# Altium project CBU-PCB.PrjPcb
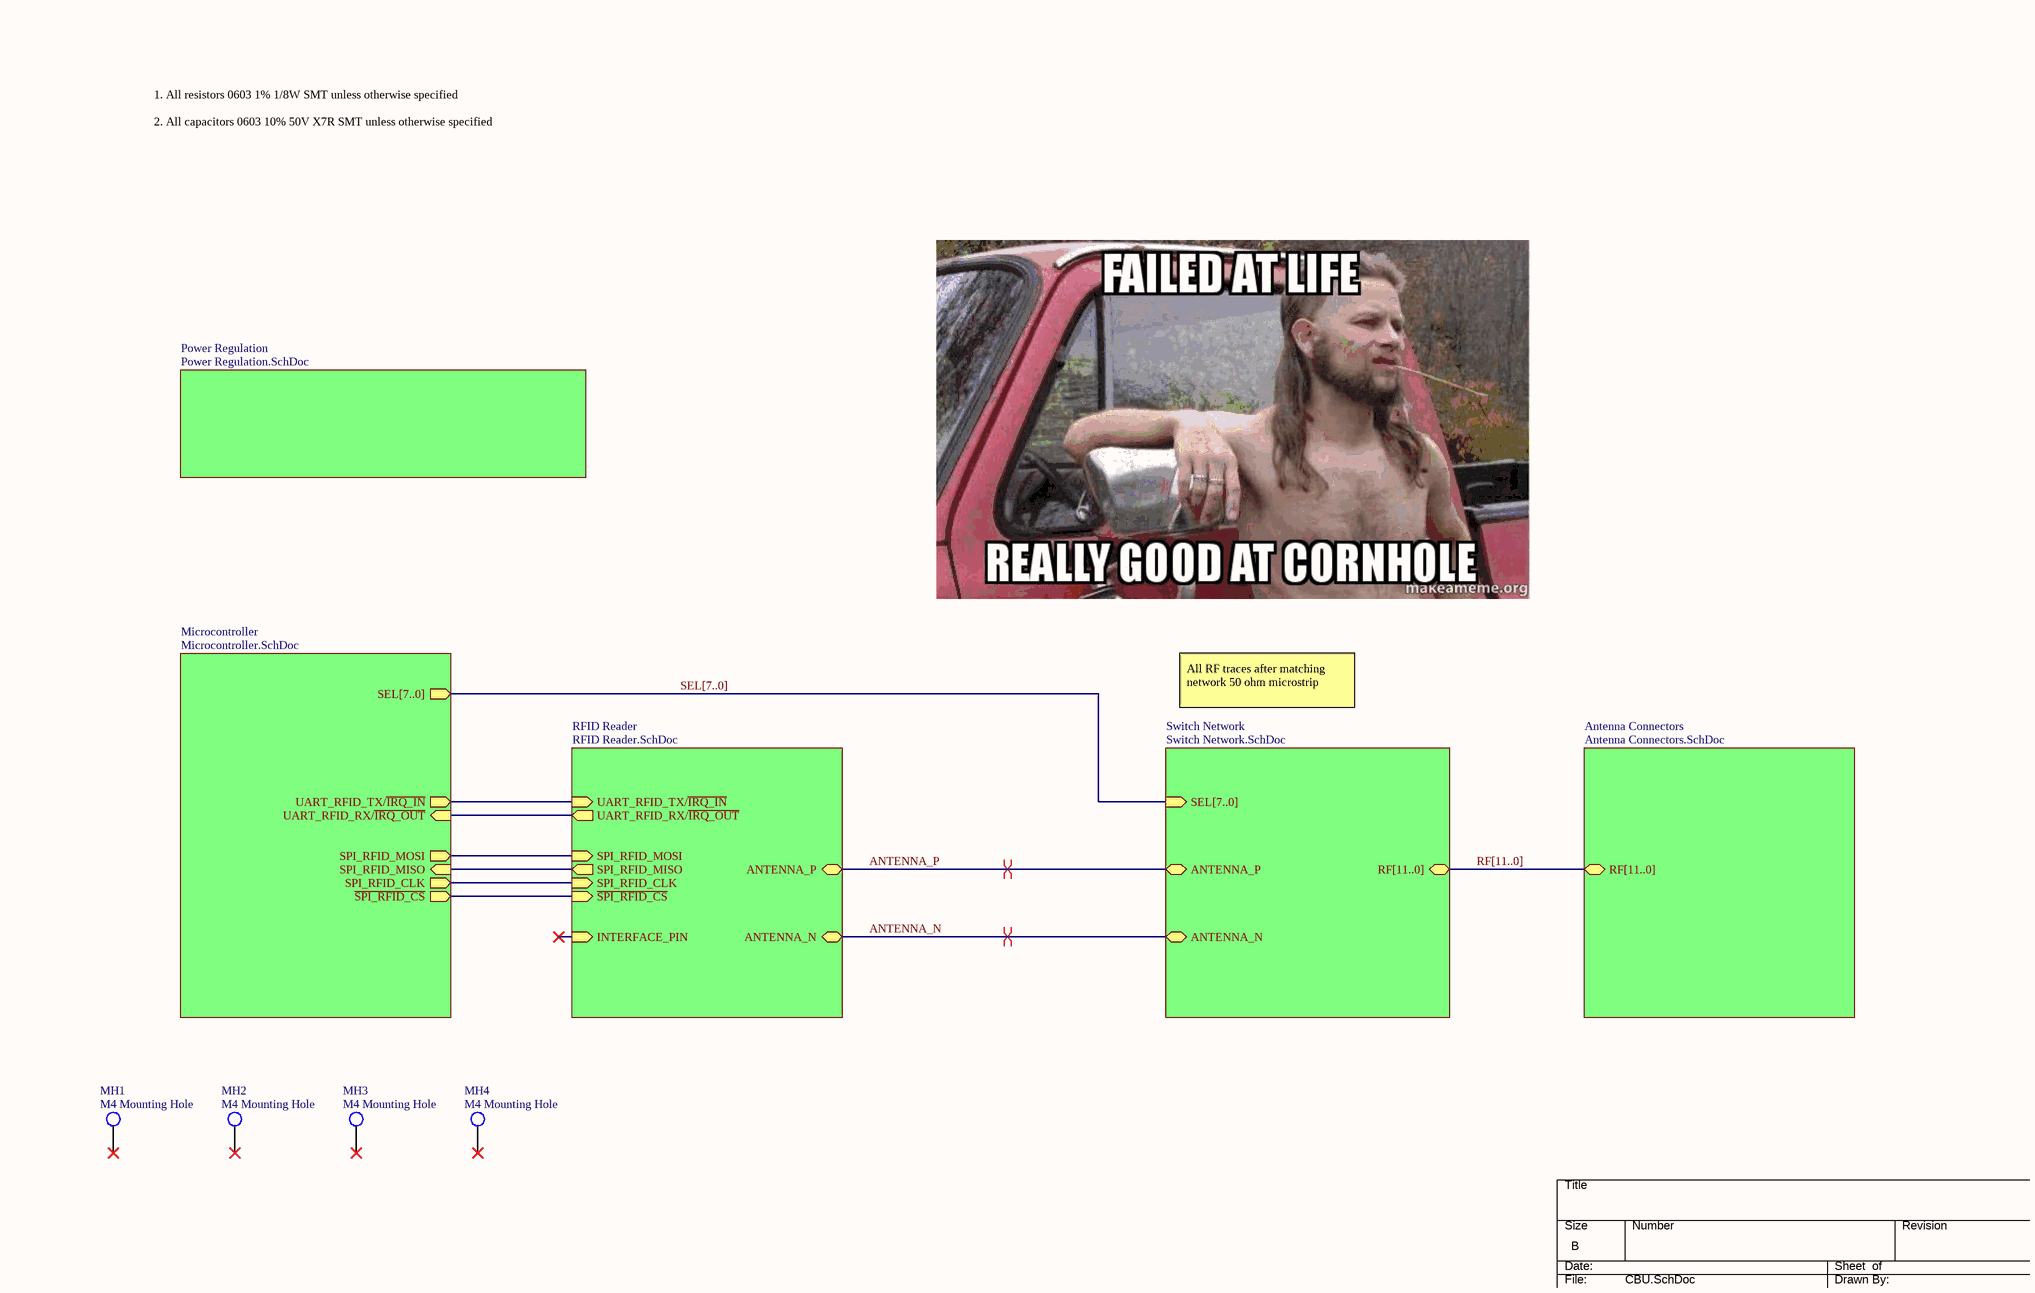
[diagram p0: CBU.SchDoc]
7 sheets, 138 parts. Net scope: hierarchical (ports join the sheet entries above them; power ports are global).
Board file: CBU-PCB.PcbDoc
Sheets:
  CBU.SchDoc
    RFID Reader = RFID Reader.SchDoc
    Switch Network = Switch Network.SchDoc
      Switch1 = RF Switch.SchDoc
      Switch2 = RF Switch.SchDoc
      Switch3 = RF Switch.SchDoc
      Switch4 = RF Switch.SchDoc
    Antenna Connectors = Antenna Connectors.SchDoc
    Microcontroller = Microcontroller.SchDoc
    Power Regulation = Power Regulation.SchDoc

## Sheet CBU.SchDoc
size B; Organization: MASA; SheetNumber: 1; SheetTotal: 7

### Parts
MH1  M4 Mounting Hole  [M4 Mounting Hole]
MH2  M4 Mounting Hole  [M4 Mounting Hole]
MH3  M4 Mounting Hole  [M4 Mounting Hole]
MH4  M4 Mounting Hole  [M4 Mounting Hole]

### Sub-sheets
Antenna Connectors = Antenna Connectors.SchDoc: RF[11..0] (bidir)
Microcontroller = Microcontroller.SchDoc: SEL[7..0] (out), UART_RFID_TX/~{IRQ_IN} (out), UART_RFID_RX/~{IRQ_OUT} (in), SPI_RFID_MOSI (out), SPI_RFID_MISO (in), SPI_RFID_CLK (out), ~{SPI_RFID_CS} (out)
Power Regulation = Power Regulation.SchDoc: no entries
RFID Reader = RFID Reader.SchDoc: ANTENNA_N (bidir), ANTENNA_P (bidir), INTERFACE_PIN (in), UART_RFID_TX/~{IRQ_IN} (in), UART_RFID_RX/~{IRQ_OUT} (out), SPI_RFID_MOSI (in), SPI_RFID_MISO (out), SPI_RFID_CLK (in), ~{SPI_RFID_CS} (in)
Switch Network = Switch Network.SchDoc: RF[11..0] (bidir), ANTENNA_P (bidir), SEL[7..0] (in), ANTENNA_N (bidir)

### Nets
ANTENNA_N: sheet RFID Reader/ANTENNA_N, sheet Switch Network/ANTENNA_N
ANTENNA_P: sheet RFID Reader/ANTENNA_P, sheet Switch Network/ANTENNA_P
~{SPI_RFID_CS}: sheet RFID Reader/~{SPI_RFID_CS}, sheet Microcontroller/~{SPI_RFID_CS}
SPI_RFID_MISO: sheet RFID Reader/SPI_RFID_MISO, sheet Microcontroller/SPI_RFID_MISO
SPI_RFID_MOSI: sheet RFID Reader/SPI_RFID_MOSI, sheet Microcontroller/SPI_RFID_MOSI
SPI_RFID_SCK: sheet RFID Reader/SPI_RFID_CLK, sheet Microcontroller/SPI_RFID_CLK
UART_RFID_RX/~{IRQ_OUT}: sheet RFID Reader/UART_RFID_RX/~{IRQ_OUT}, sheet Microcontroller/UART_RFID_RX/~{IRQ_OUT}
UART_RFID_TX/~{IRQ_IN}: sheet RFID Reader/UART_RFID_TX/~{IRQ_IN}, sheet Microcontroller/UART_RFID_TX/~{IRQ_IN}

Not connected (* = marked no-connect by the designer): MH1 1*; MH2 1*; MH3 1*; MH4 1*

### Buses and harness runs
bus RF[11..0] = sheet Antenna Connectors/RF[11..0] = sheet Switch Network/RF[11..0]
bus SEL[7..0] = sheet Microcontroller/SEL[7..0] = sheet Switch Network/SEL[7..0]

### Layout directives
differential pair: ANTENNA_N, ANTENNA_P

### Notes on the sheet
- 1. All resistors 0603 1% 1/8W SMT unless otherwise specified
  2. All capacitors 0603 10% 50V X7R SMT unless otherwise specified
- All RF traces after matching network 50 ohm microstrip
- DWG. NO.
- REV.
- SHT.
- THIS DOCUMENT AND THE DATA DISCLOSED HEREIN OR HEREWITH IS THE PROPERTY OF ALTIUM LIMITED AND MAY BE FREELY DISTRIBUTED IN WHOLE. NO RIGHTS ARE RESERVED OR EXPRESS OR IMPLIED WARANTEE GIVEN.
- REVISION
- DESCRIPTION
- DATE
- APPROVED
- ENG:
- APPROVALS
- PROJECT
- DSN:
- CHK:
- REFERENCE DOCUMENTS
- PROJECT REVISION:
- TITLE
- DOCUMENT REVISION:
- DESIGN ITEM:
- BOM:
- FAB DWG:
- PCB DWG:
- ASSY DWG:
- SCALE:
- SIZE
- B
- CAGE CODE
- FILE NAME
- DWG NO.
- SHEET
- OF
- REV

## Sheet RFID Reader.SchDoc
size B; Organization: MASA; SheetNumber: 2; SheetTotal: 7
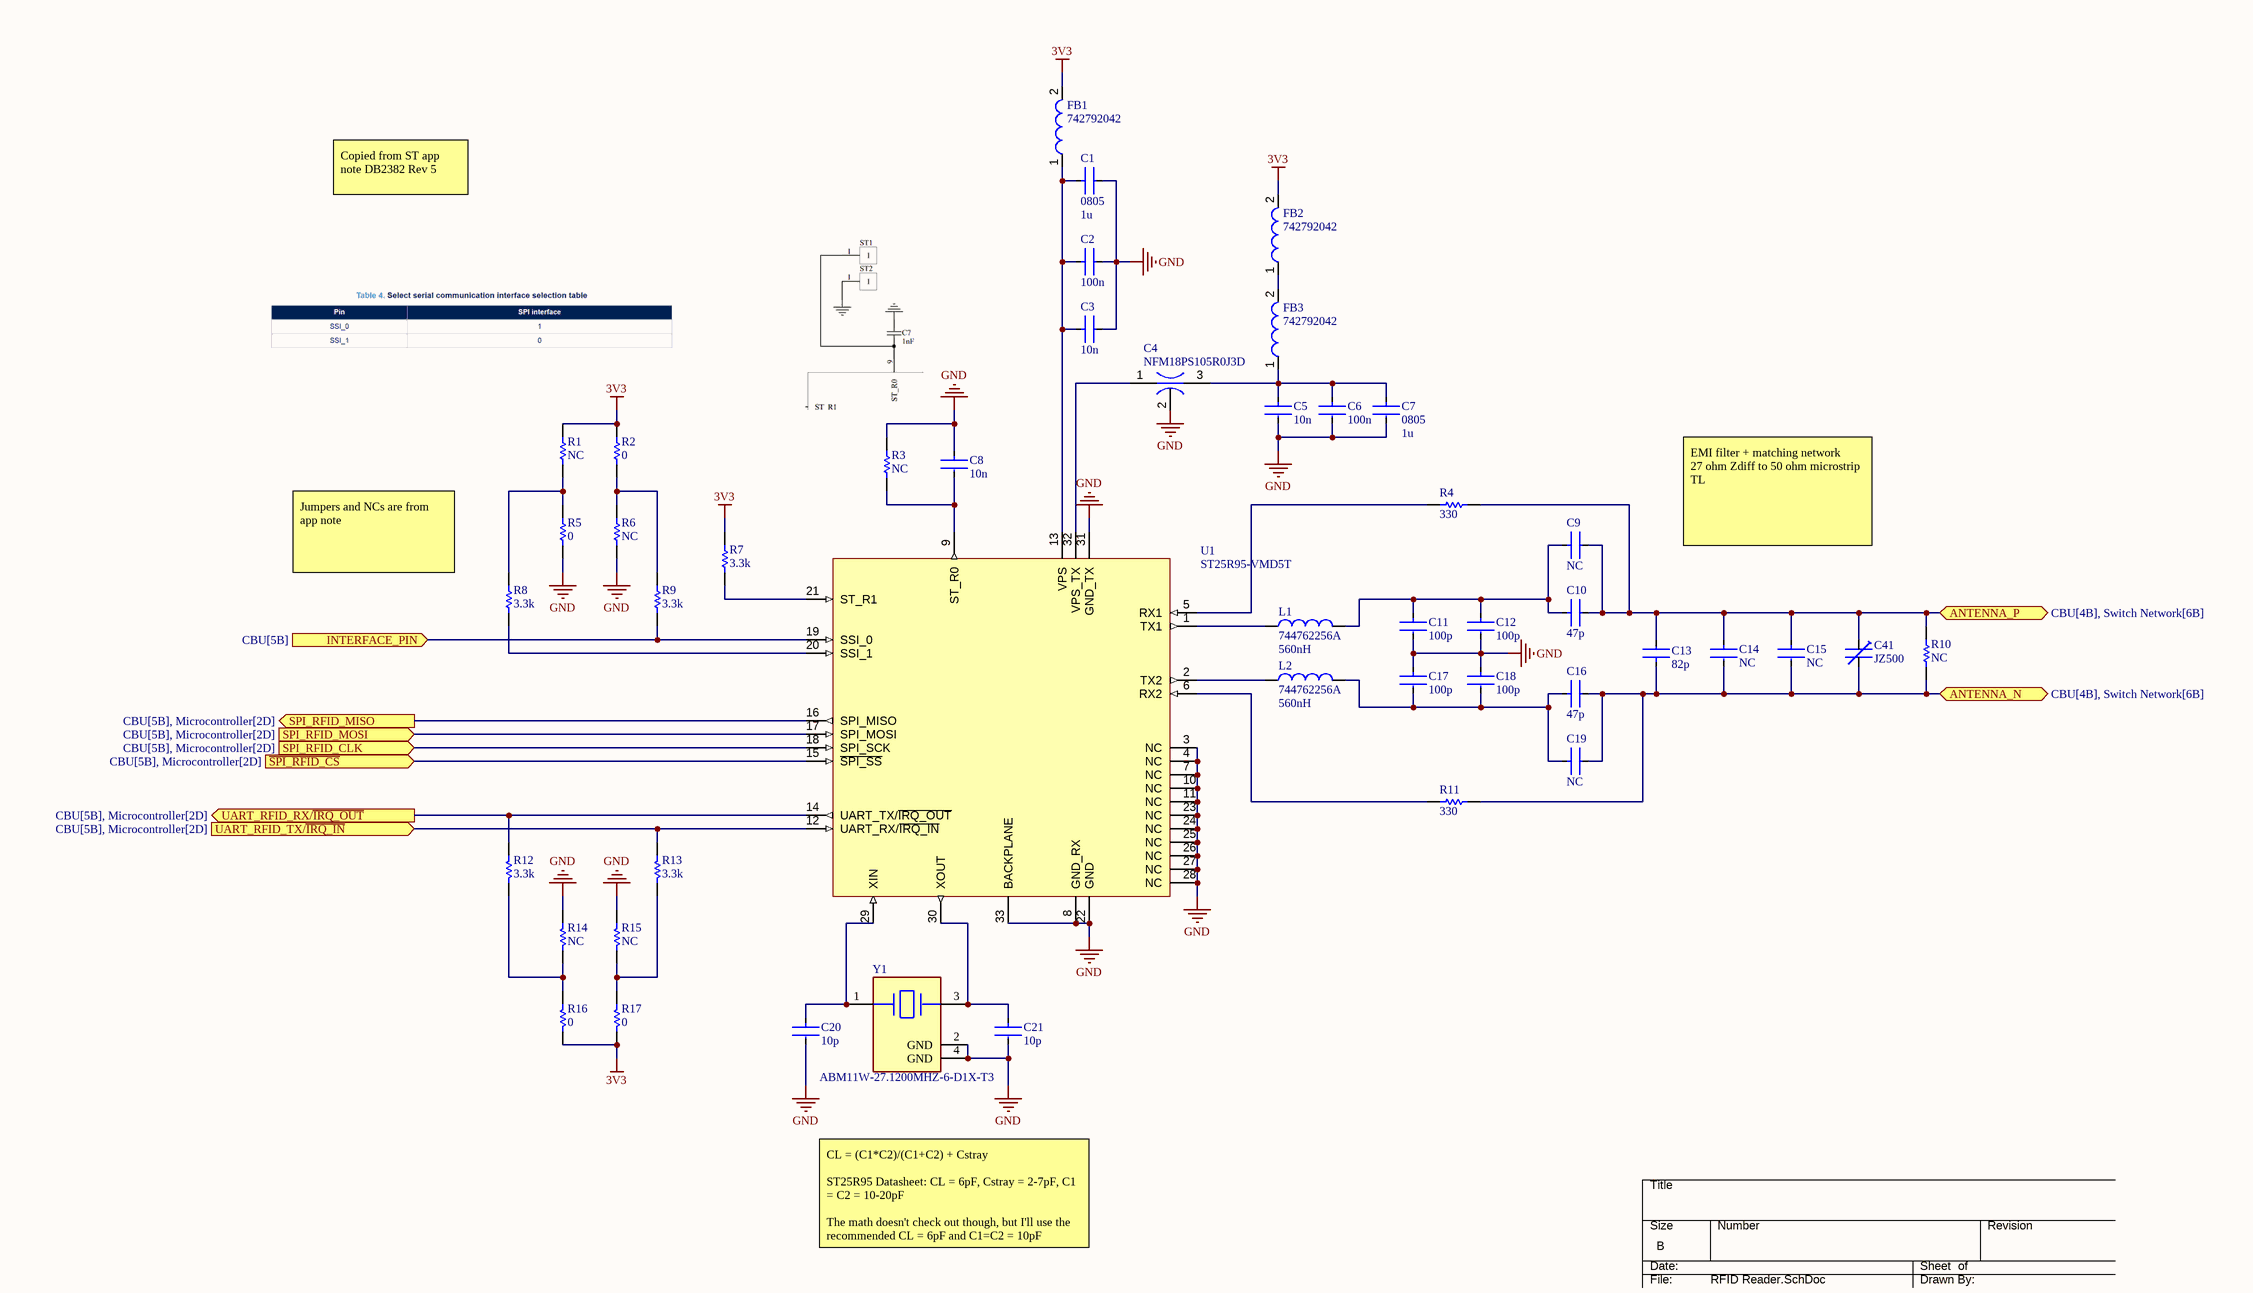
[diagram p1: RFID Reader.SchDoc]

### Parts
C1  value 1u  Package: 0805  [FP-0805-Capacitor-CL21-IPC_B]  (hidden comment: Ceramic Capacitor 0805)
C2  value 100n  [FP-0603-Capacitor-CL10-IPC_B]  (hidden comment: Ceramic Capacitor 0603)
C3  value 10n  [FP-0603-Capacitor-CL10-IPC_B]  (hidden comment: Ceramic Capacitor 0603)
C4  NFM18PS105R0J3D  [FP-NFM18-0_1-e0_05_0_35-MFG]
C5  value 10n  [FP-0603-Capacitor-CL10-IPC_B]  (hidden comment: Ceramic Capacitor 0603)
C6  value 100n  [FP-0603-Capacitor-CL10-IPC_B]  (hidden comment: Ceramic Capacitor 0603)
C7  value 1u  Package: 0805  [FP-0805-Capacitor-CL21-IPC_B]  (hidden comment: Ceramic Capacitor 0805)
C8  value 10n  [FP-0603-Capacitor-CL10-IPC_B]  (hidden comment: Ceramic Capacitor 0603)
C9  value NC  [FP-0603-Capacitor-CL10-IPC_B]  (hidden comment: Ceramic Capacitor 0603)
C10  value 47p  [FP-0603-Capacitor-CL10-IPC_B]  (hidden comment: Ceramic Capacitor 0603)
C11  value 100p  [FP-0603-Capacitor-CL10-IPC_B]  (hidden comment: Ceramic Capacitor 0603)
C12  value 100p  [FP-0603-Capacitor-CL10-IPC_B]  (hidden comment: Ceramic Capacitor 0603)
C13  value 82p  [FP-0603-Capacitor-CL10-IPC_B]  (hidden comment: Ceramic Capacitor 0603)
C14  value NC  [FP-0603-Capacitor-CL10-IPC_B]  (hidden comment: Ceramic Capacitor 0603)
C15  value NC  [FP-0603-Capacitor-CL10-IPC_B]  (hidden comment: Ceramic Capacitor 0603)
C16  value 47p  [FP-0603-Capacitor-CL10-IPC_B]  (hidden comment: Ceramic Capacitor 0603)
C17  value 100p  [FP-0603-Capacitor-CL10-IPC_B]  (hidden comment: Ceramic Capacitor 0603)
C18  value 100p  [FP-0603-Capacitor-CL10-IPC_B]  (hidden comment: Ceramic Capacitor 0603)
C19  value NC  [FP-0603-Capacitor-CL10-IPC_B]  (hidden comment: Ceramic Capacitor 0603)
C20  value 10p  [FP-0603-Capacitor-CL10-IPC_B]  (hidden comment: Ceramic Capacitor 0603)
C21  value 10p  [FP-0603-Capacitor-CL10-IPC_B]  (hidden comment: Ceramic Capacitor 0603)
C41  JZ500  [JZXXX_Trim_Capacitor]
FB1  742792042  [742792042]
FB2  742792042  [742792042]
FB3  742792042  [742792042]
L1  744762256A  Inductance: 560nH  [744762256A]
L2  744762256A  Inductance: 560nH  [744762256A]
R1  value NC  [RESC1608X55X25NL10T15]  (hidden comment: RC0603FR-072K2L)
R2  value 0  [RESC1608X55X25NL10T15]  (hidden comment: RC0603FR-072K2L)
R3  value NC  [RESC1608X55X25NL10T15]  (hidden comment: RC0603FR-072K2L)
R4  value 330  [RESC1608X55X25NL10T15]  (hidden comment: RC0603FR-072K2L)
R5  value 0  [RESC1608X55X25NL10T15]  (hidden comment: RC0603FR-072K2L)
R6  value NC  [RESC1608X55X25NL10T15]  (hidden comment: RC0603FR-072K2L)
R7  value 3.3k  [RESC1608X55X25NL10T15]  (hidden comment: RC0603FR-072K2L)
R8  value 3.3k  [RESC1608X55X25NL10T15]  (hidden comment: RC0603FR-072K2L)
R9  value 3.3k  [RESC1608X55X25NL10T15]  (hidden comment: RC0603FR-072K2L)
R10  value NC  [RESC1608X55X25NL10T15]  (hidden comment: RC0603FR-072K2L)
R11  value 330  [RESC1608X55X25NL10T15]  (hidden comment: RC0603FR-072K2L)
R12  value 3.3k  [RESC1608X55X25NL10T15]  (hidden comment: RC0603FR-072K2L)
R13  value 3.3k  [RESC1608X55X25NL10T15]  (hidden comment: RC0603FR-072K2L)
R14  value NC  [RESC1608X55X25NL10T15]  (hidden comment: RC0603FR-072K2L)
R15  value NC  [RESC1608X55X25NL10T15]  (hidden comment: RC0603FR-072K2L)
R16  value 0  [RESC1608X55X25NL10T15]  (hidden comment: RC0603FR-072K2L)
R17  value 0  [RESC1608X55X25NL10T15]  (hidden comment: RC0603FR-072K2L)
U1  ST25R95-VMD5T  [ST25R95-VMD5T]
Y1  ABM11W-27.1200MHZ-6-D1X-T3  [FP-ABM11W-MFG]

### Ports
ANTENNA_N (bidir, see CBU[4B], Switch Network[6B]), ANTENNA_P (bidir, see CBU[4B], Switch Network[6B]), INTERFACE_PIN (in, see CBU[5B]), SPI_RFID_CLK (in, see CBU[5B], Microcontroller[2D]), SPI_RFID_MISO (out, see CBU[5B], Microcontroller[2D]), SPI_RFID_MOSI (in, see CBU[5B], Microcontroller[2D]), UART_RFID_RX/~{IRQ_OUT} (out, see CBU[5B], Microcontroller[2D]), UART_RFID_TX/~{IRQ_IN} (in, see CBU[5B], Microcontroller[2D]), ~{SPI_RFID_CS} (in, see CBU[5B], Microcontroller[2D])

### Nets
3V3: FB1.2 FB2.2 R1.2 R2.2 R7.2 R16.2 R17.2
GND: C1.2 C2.2 C3.2 C4.2(GND) C5.2 C6.2 C7.2 C8.1 C11.2 C12.2 C17.1 C18.1 C20.2 C21.2 R3.1 R5.1 R6.1 R14.1 R15.1 U1.3(NC) U1.4(NC) U1.7(NC) U1.8(GND_RX) U1.10(NC) U1.11(NC) U1.22(GND) U1.23(NC) U1.24(NC) U1.25(NC) U1.26(NC) U1.27(NC) U1.28(NC) U1.31(GND_TX) U1.33(BACKPLANE) Y1.2(GND) Y1.4(GND)
ANTENNA_N: C13.1 C14.2 C15.2 C16.2 C19.2 C41.2 R10.1 R11.1 ; port ANTENNA_N
ANTENNA_P: C9.2 C10.2 C13.2 C14.1 C15.1 C41.1 R4.1 R10.2 ; port ANTENNA_P
~{SPI_RFID_CS}: U1.15(~{SPI_SS}) ; port ~{SPI_RFID_CS}
SPI_RFID_MISO: U1.16(SPI_MISO) ; port SPI_RFID_MISO
SPI_RFID_MOSI: U1.17(SPI_MOSI) ; port SPI_RFID_MOSI
SPI_RFID_SCK: U1.18(SPI_SCK) ; port SPI_RFID_CLK
UART_RFID_RX/~{IRQ_OUT}: R12.1 U1.14(UART_TX/~{IRQ_OUT}) ; port UART_RFID_RX/~{IRQ_OUT}
UART_RFID_TX/~{IRQ_IN}: R13.1 U1.12(UART_RX/~{IRQ_IN}) ; port UART_RFID_TX/~{IRQ_IN}
NetC1_1: C1.1 C2.1 C3.1 FB1.1 U1.13(VPS)
NetC4_1: C4.1(Input) U1.32(VPS_TX)
NetC4_3: C4.3(Output) C5.1 C6.1 C7.1 FB3.1
NetC8_2: C8.2 R3.2 U1.9(ST_R0)
NetC9_1: C9.1 C10.1 C11.1 C12.1 L1.2
NetC16_1: C16.1 C17.2 C18.2 C19.1 L2.2
NetC20_1: C20.1 U1.29(XIN) Y1.1
NetC21_1: C21.1 U1.30(XOUT) Y1.3
NetFB2_1: FB2.1 FB3.2
NetL1_1: L1.1 U1.1(TX1)
NetL2_1: L2.1 U1.2(TX2)
NetR1_1: R1.1 R5.2 R8.2
NetR2_1: R2.1 R6.2 R9.2
NetR4_2: R4.2 U1.5(RX1)
NetR7_1: R7.1 U1.21(ST_R1)
NetR8_1: R8.1 U1.20(SSI_1)
NetR9_1: R9.1 U1.19(SSI_0) ; port INTERFACE_PIN
NetR11_2: R11.2 U1.6(RX2)
NetR12_2: R12.2 R14.2 R16.1
NetR13_2: R13.2 R15.2 R17.1

### Notes on the sheet
- Copied from ST app note DB2382 Rev 5
- Jumpers and NCs are from app note
- EMI filter + matching network
  27 ohm Zdiff to 50 ohm microstrip TL
- CL = (C1*C2)/(C1+C2) + Cstray
  ST25R95 Datasheet: CL = 6pF, Cstray = 2-7pF, C1 = C2 = 10-20pF
  The math doesn't check out though, but I'll use the recommended CL = 6pF and C1=C2 = 10pF
- DWG. NO.
- REV.
- SHT.
- THIS DOCUMENT AND THE DATA DISCLOSED HEREIN OR HEREWITH IS THE PROPERTY OF ALTIUM LIMITED AND MAY BE FREELY DISTRIBUTED IN WHOLE. NO RIGHTS ARE RESERVED OR EXPRESS OR IMPLIED WARANTEE GIVEN.
- REVISION
- DESCRIPTION
- DATE
- APPROVED
- ENG:
- APPROVALS
- PROJECT
- DSN:
- CHK:
- REFERENCE DOCUMENTS
- PROJECT REVISION:
- TITLE
- DOCUMENT REVISION:
- DESIGN ITEM:
- BOM:
- FAB DWG:
- PCB DWG:
- ASSY DWG:
- SCALE:
- SIZE
- B
- CAGE CODE
- FILE NAME
- DWG NO.
- SHEET
- OF
- REV

### Library data of the parts
C1 C7 = Ceramic Capacitor 0805: CAP CER 50V X7R 0805; Manufacturer: KEMET; Manufacturer Part Number: C0603C104K5RACTU; Tolerance: 0.1; Temperature Coefficient: 30ppm/°C; Automotive Grade: Grade 1; Temperature: -55°C to +125°C; RoHS: TRUE; Material: Ceramic; Temperature Range High: +125°C; Lead Free: Yes; Octopart: https://octopart.com/c0603c104k5ractu-kemet-139244; Digikey Description: CAP CER 0.1UF 50V X7R 0603; Category: Cap; ComponentLink2Description: Datasheet; Temperature Range Low: -55°C; Device Class L1: Passive Components; Voltage Rating: 50 V; Automotive: Yes; Device Class L3: Ceramic Capacitors; ComponentLink2URL: https://api.kemet.com/component-edge/download/datasheet/C0603C100J5GACAUTO.pdf; Device Class L2: Capacitors; Temperature Characteristic: X7R; Height: 0.87mm; Supplier 1: Arrow Electronics; Supplier Part Number 1: CL21B105KBFNNNG
C2 C3 C5 C6 C8-C21 = Ceramic Capacitor 0603: CAP CER 50V X7R 0603; Manufacturer: KEMET; Manufacturer Part Number: C0603C104K5RACTU; Tolerance: 0.1; Temperature Coefficient: 30ppm/°C; Automotive Grade: Grade 1; Temperature: -55°C to +125°C; RoHS: TRUE; Material: Ceramic; Temperature Range High: +125°C; Lead Free: Yes; Octopart: https://octopart.com/c0603c104k5ractu-kemet-139244; Digikey Description: CAP CER 0.1UF 50V X7R 0603; Category: Cap; Package: C0603C-CF; ComponentLink2Description: Datasheet; Temperature Range Low: -55°C; Device Class L1: Passive Components; Voltage Rating: 50 V; Automotive: Yes; Device Class L3: Ceramic Capacitors; ComponentLink2URL: https://api.kemet.com/component-edge/download/datasheet/C0603C100J5GACAUTO.pdf; Device Class L2: Capacitors; Temperature Characteristic: X7R; Height: 0.87mm; Supplier 1: Mouser; Supplier Part Number 1: 80-C0201C120K3G
C4 = NFM18PS105R0J3D: Large Current 3 Terminals Low ESL Chip Multilayer Ceramic Capacitors for General Purpose, 0603, 1uF, 20%, 6.3V; Current Rating: 2A; DC Resistance (DCR): 30mR; Insulation Resistance: 500MR; Max Voltage Rating (DC): 6.3V; Voltage: 6.3V; Weight: 7.1E-05oz; Height: 0.6mm; Lead Free: Lead Free; REACH SVHC: No SVHC; Max Operating Temperature: 105°C; Min Operating Temperature: -55°C; Mount: Surface Mount; Capacitance: 1uF; Width: 0.8mm; Radiation Hardening: No; Max Current Rating: 2A; Case Code (Imperial): 0603; Voltage Rating (DC): 6.3V; Length: 1.6mm; Case/Package: 0603; Case Code (Metric): 1608; Package Quantity: 1; Tolerance: 20%; Current: 2A; Packaging: Tape and Reel; Depth: 0.8mm; Voltage Rating: 6.3V; Termination: Flat; Supplier 1: Arrow Electronics; Supplier Part Number 1: NFM18PS105R0J3D
C41 = JZ500: 8 ~ 50pF Trimmer Capacitor 125 V Top Surface Mount
FB1-FB3 = 742792042: SMD EMI Suppression Ferrite Bead WE-CBF, Z = 600 Ohm; Impedance: 600 Ohm; PackageDescription: Chip Inductor, 2-Leads, Body 2.0 x 1.2 mm; ComponentLink1Description: Manufacturer Link; PackageVersion: 2005; PackageReference: SMD-0805; ComponentLink2URL: http://www.we-online.de/katalog/media/pdf/742792042.pdf; ComponentLink2Description: Datasheet; DatasheetVersion: Dec-2005; ComponentLink1URL: http://www.we-online.com; Supplier 1: Digi-Key; Supplier Part Number 1: 732-4642-1-ND
L1 L2 = 744762256A: 744762256A General Purpose Inductor, 0.56uH, 5%, 1 Element, Ceramic-Core, SMD, 1008; NexarPartId: 23392503; Max DC Current: 310mA; Frequency: 100MHz; Resistance: 1.17Ω; DC Resistance (DCR): 1.5Ω; Q Factor: 45; Shielding: Unshielded; Self Resonant Frequency: 430MHz; Inductance Tolerance: 5%; Packaging: Digi-Reel®; Case/Package: 1008; Core Material: Ceramic; Composition: Ceramic, Wirewound; Material: Ceramic; Termination: SMD/SMT; Case Code (Imperial): 1008; Weight: 20mg; Max Operating Temperature: 125°C; Current Rating: 310mA; Length: 2.5mm; Min Operating Temperature: -40°C; Height - Seated (Max): 1.905mm; Height: 1.6mm; Series Resistance: 1.5Ω; RoHS: Compliant; Ambient Temperature Range Low: -40°C; Width: 2mm; Mount: Surface Mount; Ambient Temperature Range High: 110°C; Test Frequency: 100MHz; Case Code (Metric): 2520; Tolerance: 5%; REACH SVHC: Unknown; Supplier 1: Digi-Key; Supplier Part Number 1: 732-1829-1-ND
R1-R17 = Resistor 0603: Thick Film Resistor, 2.2 KOhm, 100 mW, 50 V, +/- 1%, -55 to 155 degC, 2-Pin SMD (0603), RoHS, Tape and Reel; Manufacturer: Yageo; Temperature Coefficient: 100PPM/C; Voltage Rating: 50V; Power Rating: 100mW; Tolerance: 1%; Datasheet Version: Rev. 7, 05/2017; Case Code - mm: 1608; Series: RC; Mounting Technology: SurfaceMount; Package Description: 2-Pin Surface Mount Device, Body 1.6 x 0.8 mm; Case Code - in: 0603; Package Reference: 0603; Product: ThickFilmResistorsGeneralPurpose; Manufacturer URL: http://www.yageo.com/; Termination Style: SMD/SMT; Operating Temperature Range: -55Cto+155C; Datasheet URL: http://www.yageo.com/documents/recent/PYu-RC_Group_51_RoHS_L_7.pdf; Packaging: Reel
U1 = ST25R95-VMD5T: RFID Reader IC 13.56MHz FeliCa, ISO 14443, ISO 15693, ISO 18000-3, MIFARE, NFC SPI 2.7V ~ 5.5V 32-VFQFN Exposed Pad; Supplier 1: Mouser; Supplier Part Number 1: 511-ST25R95-VMD5T
Y1 = ABM11W-27.1200MHZ-6-D1X-T3: Crystal 27.12MHz ±10ppm 6pF SMD-4 2mm x 1.6mm; ESR (Equivalent Series Resistance): 100R; Frequency Stability: 20ppm; Load Capacitance: 6pF; Case/Package: SMD/SMT; Min Operating Temperature: -40°C; Max Operating Temperature: 85°C; Frequency: 27.12MHz; Frequency Tolerance: 10ppm; Mount: Surface Mount; Packaging: Tape and Reel; Supplier 1: Digi-Key; Supplier Part Number 1: 535-13879-1-ND

## Sheet Switch Network.SchDoc
size B; Organization: MASA; SheetNumber: 3; SheetTotal: 7
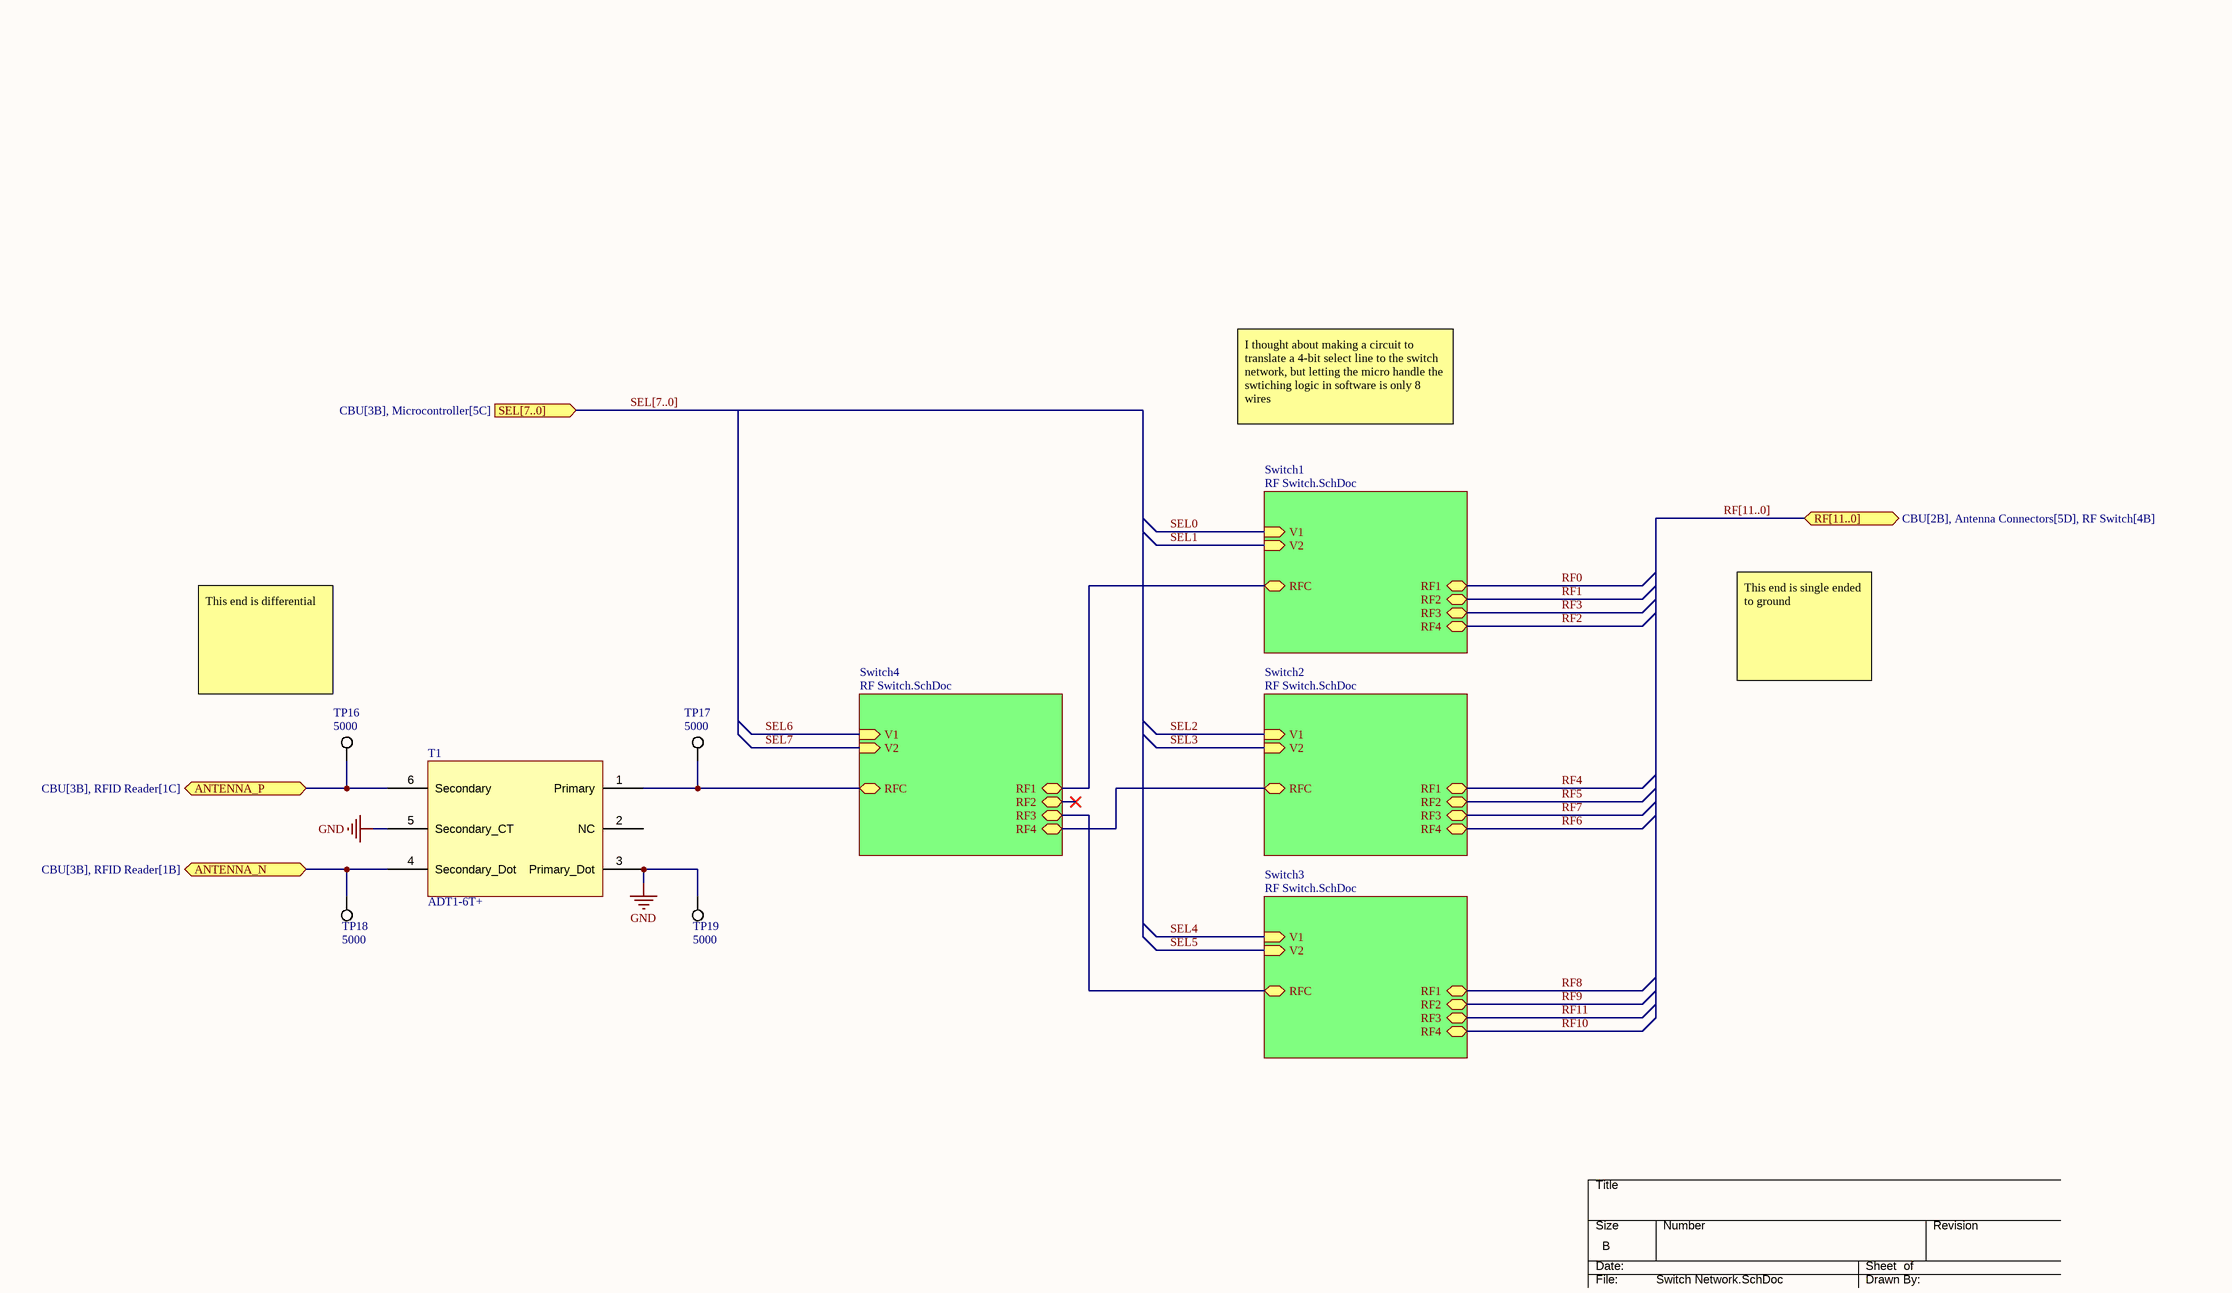
[diagram p2: Switch Network.SchDoc]

### Parts
T1  ADT1-6T+  [ADT1-6T+]
TP16  5000  [FP-5000-MFG]
TP17  5000  [FP-5000-MFG]
TP18  5000  [FP-5000-MFG]
TP19  5000  [FP-5000-MFG]

### Sub-sheets
Switch1 = RF Switch.SchDoc: V1 (in), V2 (in), RF1 (bidir), RF2 (bidir), RF3 (bidir), RF4 (bidir), RFC (bidir)
Switch2 = RF Switch.SchDoc: V1 (in), V2 (in), RF1 (bidir), RF2 (bidir), RF3 (bidir), RF4 (bidir), RFC (bidir)
Switch3 = RF Switch.SchDoc: V1 (in), V2 (in), RF1 (bidir), RF2 (bidir), RF3 (bidir), RF4 (bidir), RFC (bidir)
Switch4 = RF Switch.SchDoc: V1 (in), V2 (in), RF1 (bidir), RF2 (bidir), RF3 (bidir), RF4 (bidir), RFC (bidir)

### Ports
ANTENNA_N (bidir, see CBU[3B], RFID Reader[1B]), ANTENNA_P (bidir, see CBU[3B], RFID Reader[1C]), RF[11..0] (bidir, see CBU[2B], Antenna Connectors[5D], RF Switch[4B]), SEL[7..0] (in, see CBU[3B], Microcontroller[5C])

### Nets
GND: T1.3(Primary_Dot) T1.5(Secondary_CT) TP19.1
ANTENNA_N: T1.4(Secondary_Dot) TP18.1 ; port ANTENNA_N
ANTENNA_P: T1.6(Secondary) TP16.1 ; port ANTENNA_P
NetT1_1: T1.1(Primary) TP17.1 ; sheet Switch4/RFC
NetU2.1_11: sheet Switch1/RFC, sheet Switch4/RF1
NetU2.2_11: sheet Switch2/RFC, sheet Switch4/RF4
NetU2.3_11: sheet Switch3/RFC, sheet Switch4/RF3

Not connected (* = marked no-connect by the designer): T1 2(NC)

### Buses and harness runs
bus RF[11..0] = port RF[11..0]
bus SEL[7..0] = port SEL[7..0]

### Notes on the sheet
- I thought about making a circuit to translate a 4-bit select line to the switch network, but letting the micro handle the swtiching logic in software is only 8 wires
- This end is differential
- This end is single ended to ground
- DWG. NO.
- REV.
- SHT.
- THIS DOCUMENT AND THE DATA DISCLOSED HEREIN OR HEREWITH IS THE PROPERTY OF ALTIUM LIMITED AND MAY BE FREELY DISTRIBUTED IN WHOLE. NO RIGHTS ARE RESERVED OR EXPRESS OR IMPLIED WARANTEE GIVEN.
- REVISION
- DESCRIPTION
- DATE
- APPROVED
- ENG:
- APPROVALS
- PROJECT
- DSN:
- CHK:
- REFERENCE DOCUMENTS
- PROJECT REVISION:
- TITLE
- DOCUMENT REVISION:
- DESIGN ITEM:
- BOM:
- FAB DWG:
- PCB DWG:
- ASSY DWG:
- SCALE:
- SIZE
- B
- CAGE CODE
- FILE NAME
- DWG NO.
- SHEET
- OF
- REV

### Library data of the parts
T1 = ADT1-6T+: RF Balun 30kHz ~ 125MHz 50 / 50Ohm 6-SMD, Flat Leads; Supplier 1: Digi-Key; Supplier Part Number 1: 3157-ADT1-6T+CT-ND
TP16-TP19 = 5000: Red PC Test Point, Miniature Phosphor Bronze Silver Plating Through Hole Mounting Type; Connector Type: Interconnection Device; Contact Finish - Termination: Silver (Ag); Reach SVHC Compliant: Yes; JESD-609 Code: e4; RoHS Compliant: Yes; Pins: 1; Mounting Technology: THT; Supplier 1: Future Electronics; Supplier Part Number 1: 8000564

## Sheet RF Switch.SchDoc
size B; Organization: MASA; SheetNumber: 4; SheetTotal: 7
Used 4 times, as channels Switch Network/Switch1, Switch Network/Switch2, Switch Network/Switch3, Switch Network/Switch4. Parts and nets are listed once, with the designators drawn on the sheet.
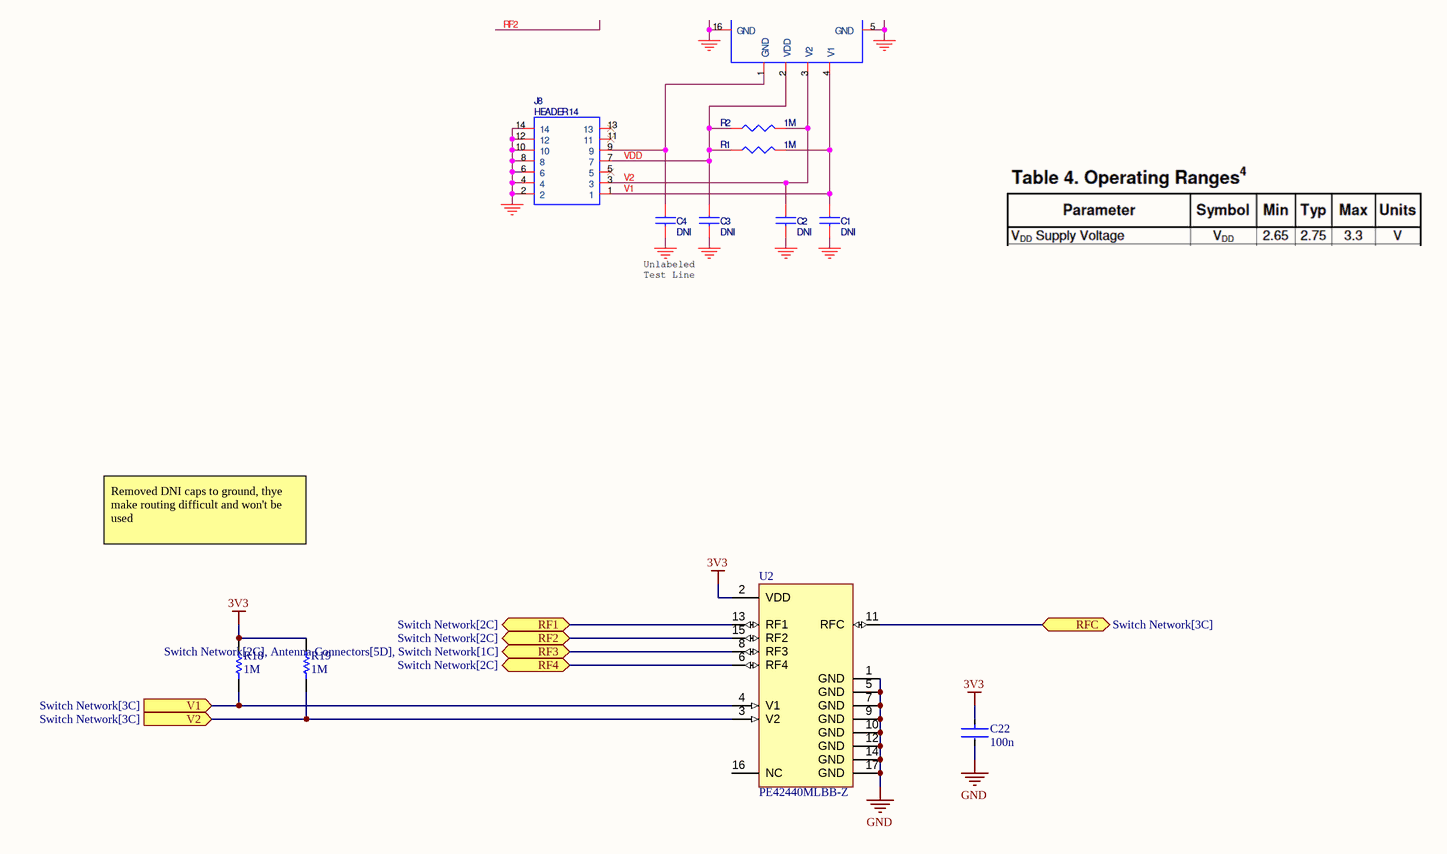
[diagram p3: RF Switch.SchDoc]

### Parts
C22  value 100n  [FP-0603-Capacitor-CL10-IPC_B]  (hidden comment: Ceramic Capacitor 0603)
R18  value 1M  [RESC1608X55X25NL10T15]  (hidden comment: RC0603FR-072K2L)
R19  value 1M  [RESC1608X55X25NL10T15]  (hidden comment: RC0603FR-072K2L)
U2  PE42440MLBB-Z  [PE42440MLBB-Z]

### Ports
RF1 (bidir, see Switch Network[2C]), RF2 (bidir, see Switch Network[2C]), RF3 (bidir, see Switch Network[2C], Antenna Connectors[5D], Switch Network[1C]), RF4 (bidir, see Switch Network[2C]), RFC (bidir, see Switch Network[3C]), V1 (in, see Switch Network[3C]), V2 (in, see Switch Network[3C])

### Nets
3V3: C22.1 R18.2 R19.2 U2.2(VDD)
GND: C22.2 U2.1(GND) U2.5(GND) U2.7(GND) U2.9(GND) U2.10(GND) U2.12(GND) U2.14(GND) U2.17(GND)
RF1: U2.13(RF1) ; port RF1
RF2: U2.15(RF2) ; port RF2
RF3: U2.8(RF3) ; port RF3
RF4: U2.6(RF4) ; port RF4
RFC: U2.11(RFC) ; port RFC
V1: R18.1 U2.4(V1) ; port V1
V2: R19.1 U2.3(V2) ; port V2

Not connected (* = marked no-connect by the designer): U2 16(NC)

### Channels
Switch Network/Switch1: designators end in .1; ports RF1=RF0 RF2=RF1 RF3=RF3 RF4=RF2 RFC=NetU2.1_11 V1=SEL0 V2=SEL1
Switch Network/Switch2: designators end in .2; ports RF1=RF4 RF2=RF5 RF3=RF7 RF4=RF6 RFC=NetU2.2_11 V1=SEL2 V2=SEL3
Switch Network/Switch3: designators end in .3; ports RF1=RF8 RF2=RF9 RF3=RF11 RF4=RF10 RFC=NetU2.3_11 V1=SEL4 V2=SEL5
Switch Network/Switch4: designators end in .4; ports RF1=NetU2.1_11 RF2=NetU2.4_15 RF3=NetU2.3_11 RF4=NetU2.2_11 RFC=NetT1_1 V1=SEL6 V2=SEL7

### Notes on the sheet
- Removed DNI caps to ground, thye make routing difficult and won't be used
- DWG. NO.
- REV.
- SHT.
- THIS DOCUMENT AND THE DATA DISCLOSED HEREIN OR HEREWITH IS THE PROPERTY OF ALTIUM LIMITED AND MAY BE FREELY DISTRIBUTED IN WHOLE. NO RIGHTS ARE RESERVED OR EXPRESS OR IMPLIED WARANTEE GIVEN.
- REVISION
- DESCRIPTION
- DATE
- APPROVED
- ENG:
- APPROVALS
- PROJECT
- DSN:
- CHK:
- REFERENCE DOCUMENTS
- PROJECT REVISION:
- TITLE
- DOCUMENT REVISION:
- DESIGN ITEM:
- BOM:
- FAB DWG:
- PCB DWG:
- ASSY DWG:
- SCALE:
- SIZE
- B
- CAGE CODE
- FILE NAME
- DWG NO.
- SHEET
- OF
- REV

### Library data of the parts
C22 = Ceramic Capacitor 0603: as C2 on sheet RFID Reader; Temperature: -55°C to +125°C; RoHS: TRUE; Material: Ceramic; Temperature Range High: +125°C; Lead Free: Yes; Octopart: https://octopart.com/c0603c104k5ractu-kemet-139244; Digikey Description: CAP CER 0.1UF 50V X7R 0603; Category: Cap; Package: C0603C-CF; ComponentLink2Description: Datasheet; Temperature Range Low: -55°C; Device Class L1: Passive Components; Voltage Rating: 50 V; Automotive: Yes; Device Class L3: Ceramic Capacitors; ComponentLink2URL: https://api.kemet.com/component-edge/download/datasheet/C0603C100J5GACAUTO.pdf; Device Class L2: Capacitors; Temperature Characteristic: X7R; Height: 0.87mm; Supplier 1: Mouser; Supplier Part Number 1: 80-C0201C120K3G
R18 R19 = Resistor 0603: as R1 on sheet RFID Reader; Tolerance: 1%; Datasheet Version: Rev. 7, 05/2017; Case Code - mm: 1608; Series: RC; Mounting Technology: SurfaceMount; Package Description: 2-Pin Surface Mount Device, Body 1.6 x 0.8 mm; Case Code - in: 0603; Package Reference: 0603; Product: ThickFilmResistorsGeneralPurpose; Manufacturer URL: http://www.yageo.com/; Termination Style: SMD/SMT; Operating Temperature Range: -55Cto+155C; Datasheet URL: http://www.yageo.com/documents/recent/PYu-RC_Group_51_RoHS_L_7.pdf; Packaging: Reel
U2 = PE42440MLBB-Z: RF Switch IC General Purpose SP4T 3 GHz 50Ohm 16-QFN (3x3); Supplier 1: Digi-Key; Supplier Part Number 1: 1046-1038-1-ND

## Sheet Antenna Connectors.SchDoc
size B; Organization: MASA; SheetNumber: 5; SheetTotal: 7
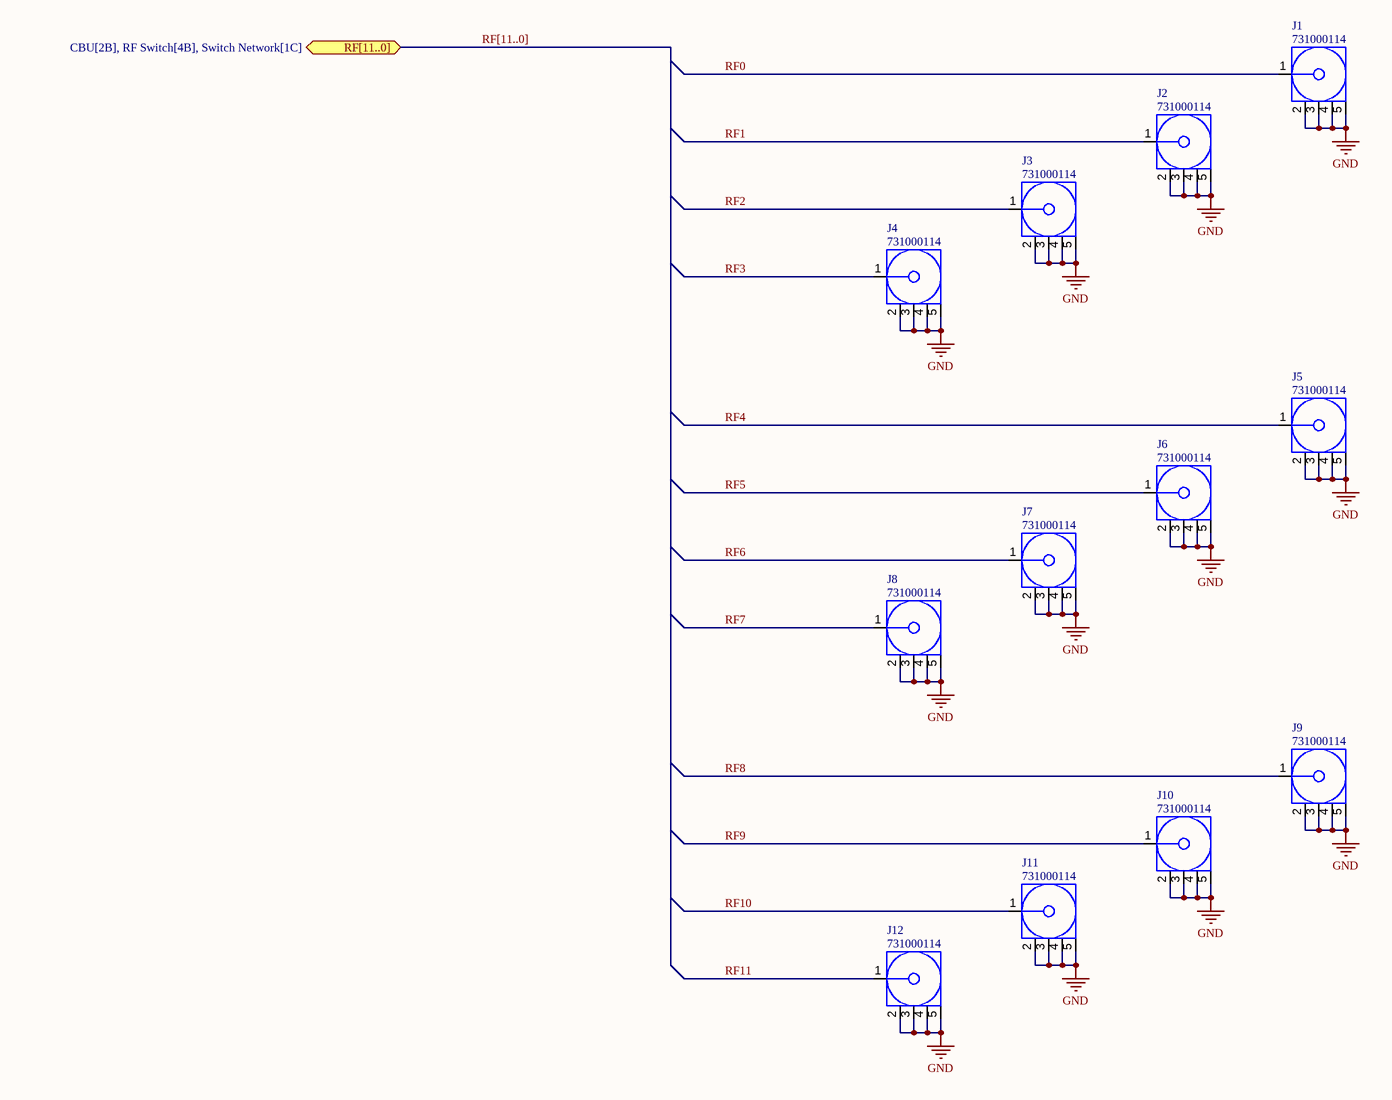
[diagram p4: Antenna Connectors.SchDoc]

### Parts
J1  731000114  [731000114_V]
J2  731000114  [731000114_V]
J3  731000114  [731000114_V]
J4  731000114  [731000114_V]
J5  731000114  [731000114_V]
J6  731000114  [731000114_V]
J7  731000114  [731000114_V]
J8  731000114  [731000114_V]
J9  731000114  [731000114_V]
J10  731000114  [731000114_V]
J11  731000114  [731000114_V]
J12  731000114  [731000114_V]

### Ports
RF[11..0] (bidir, see CBU[2B], RF Switch[4B], Switch Network[1C])

### Nets
GND: J1.2 J1.3 J1.4 J1.5 J2.2 J2.3 J2.4 J2.5 J3.2 J3.3 J3.4 J3.5 J4.2 J4.3 J4.4 J4.5 J5.2 J5.3 J5.4 J5.5 J6.2 J6.3 J6.4 J6.5 J7.2 J7.3 J7.4 J7.5 J8.2 J8.3 J8.4 J8.5 J9.2 J9.3 J9.4 J9.5 J10.2 J10.3 J10.4 J10.5 J11.2 J11.3 J11.4 J11.5 J12.2 J12.3 J12.4 J12.5
RF0: J1.1
RF1: J2.1
RF2: J3.1
RF3: J4.1
RF4: J5.1
RF5: J6.1
RF6: J7.1
RF7: J8.1
RF8: J9.1
RF9: J10.1
RF10: J11.1
RF11: J12.1

### Buses and harness runs
bus RF[11..0] = port RF[11..0]

### Notes on the sheet
- DWG. NO.
- REV.
- SHT.
- THIS DOCUMENT AND THE DATA DISCLOSED HEREIN OR HEREWITH IS THE PROPERTY OF ALTIUM LIMITED AND MAY BE FREELY DISTRIBUTED IN WHOLE. NO RIGHTS ARE RESERVED OR EXPRESS OR IMPLIED WARANTEE GIVEN.
- REVISION
- DESCRIPTION
- DATE
- APPROVED
- ENG:
- APPROVALS
- PROJECT
- DSN:
- CHK:
- REFERENCE DOCUMENTS
- PROJECT REVISION:
- TITLE
- DOCUMENT REVISION:
- DESIGN ITEM:
- BOM:
- FAB DWG:
- PCB DWG:
- ASSY DWG:
- SCALE:
- SIZE
- B
- CAGE CODE
- FILE NAME
- DWG NO.
- SHEET
- OF
- REV

### Library data of the parts
J1-J12 = 731000114: SMA Right-Angle PCB Jack Receptacle, Brass Body, Gold Plated, 50 Ohm, 5-Pin THD, RoHS, Tray; Manufacturer: Molex; Datasheet Version: 09/2016; Package Description: 5-Pin Through Hole Device, Body 14.8 x 6.35 mm, Pitch 2.54 mm; Datasheet URL: http://www.molex.com/webdocs/datasheets/pdf/en-us/0731000114_RF_COAX_CONNECTORS.pdf; Manufacturer URL: http://www.molex.com/; Package Reference: 731000114; Mounting Technology: ThroughHole; Package URL: http://www.molex.com/pdm_docs/sd/731000114_sd.pdf

## Sheet Microcontroller.SchDoc
size B; Organization: MASA; SheetNumber: 6; SheetTotal: 7
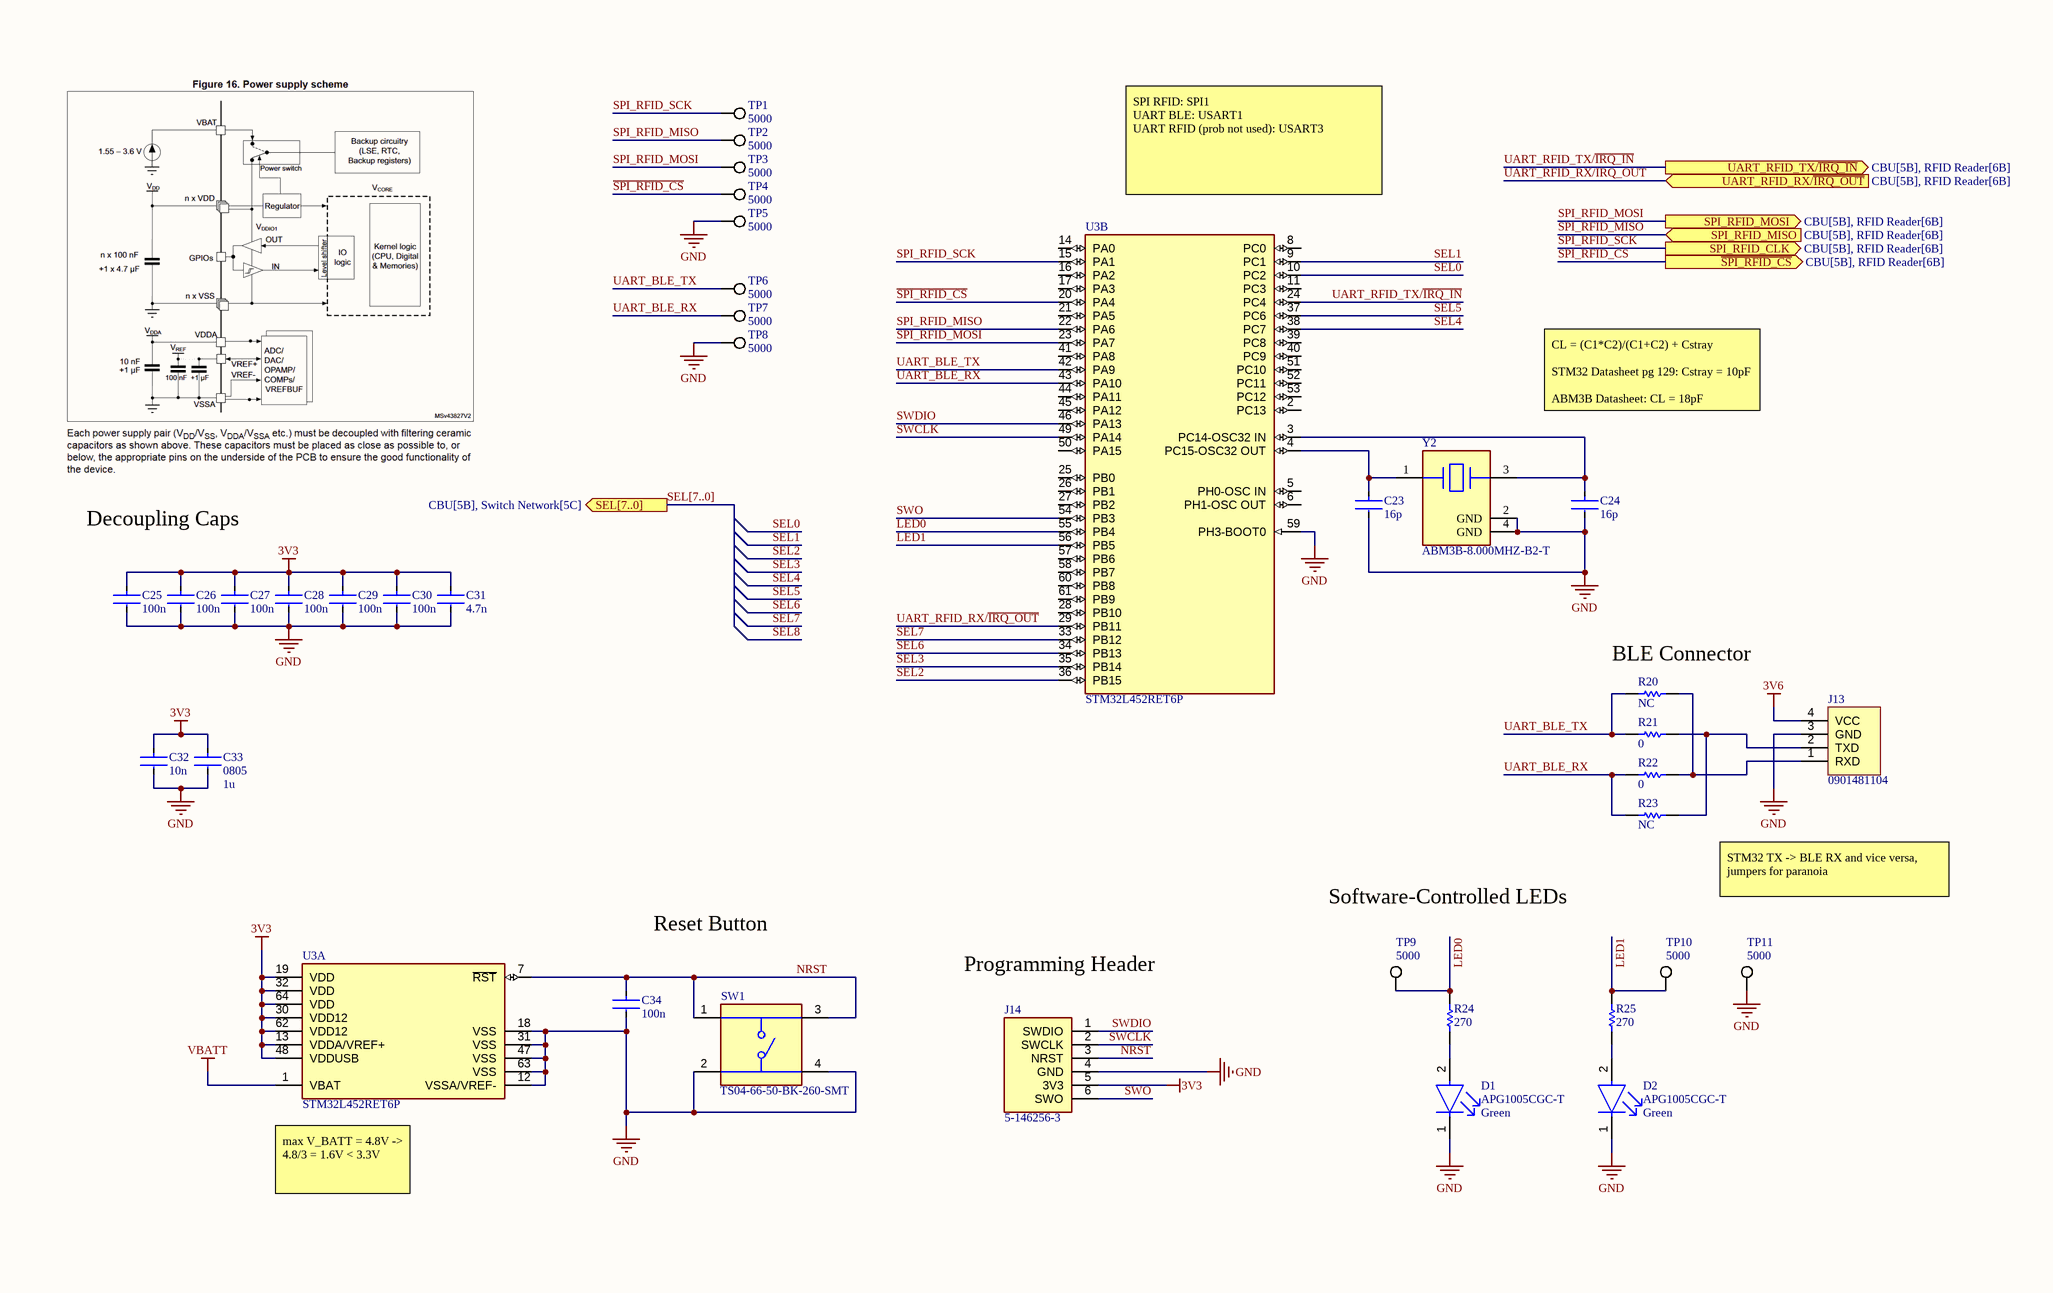
[diagram p5: Microcontroller.SchDoc]

### Parts
C23  value 16p  [FP-0603-Capacitor-CL10-IPC_B]  (hidden comment: Ceramic Capacitor 0603)
C24  value 16p  [FP-0603-Capacitor-CL10-IPC_B]  (hidden comment: Ceramic Capacitor 0603)
C25  value 100n  [FP-0603-Capacitor-CL10-IPC_B]  (hidden comment: Ceramic Capacitor 0603)
C26  value 100n  [FP-0603-Capacitor-CL10-IPC_B]  (hidden comment: Ceramic Capacitor 0603)
C27  value 100n  [FP-0603-Capacitor-CL10-IPC_B]  (hidden comment: Ceramic Capacitor 0603)
C28  value 100n  [FP-0603-Capacitor-CL10-IPC_B]  (hidden comment: Ceramic Capacitor 0603)
C29  value 100n  [FP-0603-Capacitor-CL10-IPC_B]  (hidden comment: Ceramic Capacitor 0603)
C30  value 100n  [FP-0603-Capacitor-CL10-IPC_B]  (hidden comment: Ceramic Capacitor 0603)
C31  value 4.7n  [FP-0603-Capacitor-CL10-IPC_B]  (hidden comment: Ceramic Capacitor 0603)
C32  value 10n  [FP-0603-Capacitor-CL10-IPC_B]  (hidden comment: Ceramic Capacitor 0603)
C33  value 1u  Package: 0805  [FP-0805-Capacitor-CL21-IPC_B]  (hidden comment: Ceramic Capacitor 0805)
C34  value 100n  [FP-0603-Capacitor-CL10-IPC_B]  (hidden comment: Ceramic Capacitor 0603)
D1  APG1005CGC-T  Color: Green  [FP-APG1005CGC-T-MFG]
D2  APG1005CGC-T  Color: Green  [FP-APG1005CGC-T-MFG]
J13  0901481104  [0901481104]
J14  5-146256-3  [TE_5-146256-3]
R20  value NC  [RESC1608X55X25NL10T15]  (hidden comment: RC0603FR-072K2L)
R21  value 0  [RESC1608X55X25NL10T15]  (hidden comment: RC0603FR-072K2L)
R22  value 0  [RESC1608X55X25NL10T15]  (hidden comment: RC0603FR-072K2L)
R23  value NC  [RESC1608X55X25NL10T15]  (hidden comment: RC0603FR-072K2L)
R24  value 270  [RESC1608X55X25NL10T15]  (hidden comment: RC0603FR-072K2L)
R25  value 270  [RESC1608X55X25NL10T15]  (hidden comment: RC0603FR-072K2L)
SW1  TS04-66-50-BK-260-SMT  [SW_TS04-66-50-BK-260-SMT]
TP1  5000  [FP-5000-MFG]
TP2  5000  [FP-5000-MFG]
TP3  5000  [FP-5000-MFG]
TP4  5000  [FP-5000-MFG]
TP5  5000  [FP-5000-MFG]
TP6  5000  [FP-5000-MFG]
TP7  5000  [FP-5000-MFG]
TP8  5000  [FP-5000-MFG]
TP9  5000  [FP-5000-MFG]
TP10  5000  [FP-5000-MFG]
TP11  5000  [FP-5000-MFG]
U3  STM32L452RET6P  [FP-STM32L452RET6P-MFG]  (parts A,B of 2)
Y2  ABM3B-8.000MHZ-B2-T  [FP-ABM3B-MFG]

### Ports
SEL[7..0] (out, see CBU[5B], Switch Network[5C]), SPI_RFID_CLK (out, see CBU[5B], RFID Reader[6B]), SPI_RFID_MISO (in, see CBU[5B], RFID Reader[6B]), SPI_RFID_MOSI (out, see CBU[5B], RFID Reader[6B]), UART_RFID_RX/~{IRQ_OUT} (in, see CBU[5B], RFID Reader[6B]), UART_RFID_TX/~{IRQ_IN} (out, see CBU[5B], RFID Reader[6B]), ~{SPI_RFID_CS} (out, see CBU[5B], RFID Reader[6B])

### Nets
3V3: C25.1 C26.1 C27.1 C28.1 C29.1 C30.1 C31.1 C32.1 C33.1 J14.5(3V3) U3.13(VDDA/VREF+) U3.19(VDD) U3.30(VDD12) U3.32(VDD) U3.48(VDDUSB) U3.62(VDD12) U3.64(VDD)
3V6: J13.4(VCC)
GND: C23.2 C24.2 C25.2 C26.2 C27.2 C28.2 C29.2 C30.2 C31.2 C32.2 C33.2 C34.2 D1.1(C) D2.1(C) J13.3(GND) J14.4(GND) SW1.2 SW1.4 TP5.1 TP8.1 TP11.1 U3.12(VSSA/VREF-) U3.18(VSS) U3.31(VSS) U3.47(VSS) U3.59(PH3-BOOT0) U3.63(VSS) Y2.2(GND) Y2.4(GND)
VBATT: U3.1(VBAT)
LED0: R24.2 TP9.1 U3.55(PB4)
LED1: R25.2 TP10.1 U3.56(PB5)
NRST: C34.1 J14.3(NRST) SW1.1 SW1.3 U3.7(~{RST})
~{SPI_RFID_CS}: TP4.1 U3.20(PA4) ; port ~{SPI_RFID_CS}
SEL0: U3.10(PC2)
SEL1: U3.9(PC1)
SEL2: U3.36(PB15)
SEL3: U3.35(PB14)
SEL4: U3.38(PC7)
SEL5: U3.37(PC6)
SEL6: U3.34(PB13)
SEL7: U3.33(PB12)
SPI_RFID_MISO: TP2.1 U3.22(PA6) ; port SPI_RFID_MISO
SPI_RFID_MOSI: TP3.1 U3.23(PA7) ; port SPI_RFID_MOSI
SPI_RFID_SCK: TP1.1 U3.15(PA1) ; port SPI_RFID_CLK
SWCLK: J14.2(SWCLK) U3.49(PA14)
SWDIO: J14.1(SWDIO) U3.46(PA13)
SWO: J14.6(SWO) U3.54(PB3)
UART_BLE_RX: R22.2 R23.1 TP7.1 U3.43(PA10)
UART_BLE_TX: R20.2 R21.1 TP6.1 U3.42(PA9)
UART_RFID_RX/~{IRQ_OUT}: U3.29(PB11) ; port UART_RFID_RX/~{IRQ_OUT}
UART_RFID_TX/~{IRQ_IN}: U3.24(PC4) ; port UART_RFID_TX/~{IRQ_IN}
NetC23_1: C23.1 U3.4(PC15-OSC32_OUT) Y2.1
NetC24_1: C24.1 U3.3(PC14-OSC32_IN) Y2.3
NetD1_2: D1.2(A) R24.1
NetD2_2: D2.2(A) R25.1
NetJ13_1: J13.1(RXD) R20.1 R22.1
NetJ13_2: J13.2(TXD) R21.2 R23.2

Not connected (* = marked no-connect by the designer): U3 2(PC13) 5(PH0-OSC_IN) 6(PH1-OSC_OUT) 8(PC0) 11(PC3) 14(PA0) 16(PA2) 17(PA3) 21(PA5) 25(PB0) 26(PB1) 27(PB2) 28(PB10) 39(PC8) 40(PC9) 41(PA8) 44(PA11) 45(PA12) 50(PA15) 51(PC10) 52(PC11) 53(PC12) 57(PB6) 58(PB7) 60(PB8) 61(PB9)

### Buses and harness runs
bus SEL[7..0] = port SEL[7..0]

### Notes on the sheet
- SPI RFID: SPI1
  UART BLE: USART1
  UART RFID (prob not used): USART3
- CL = (C1*C2)/(C1+C2) + Cstray
  STM32 Datasheet pg 129: Cstray = 10pF
  ABM3B Datasheet: CL = 18pF
- Decoupling Caps
- (near R20) BLE Connector
- Software-Controlled LEDs
- STM32 TX -> BLE RX and vice versa, jumpers for paranoia
- Reset Button
- Programming Header
- (near U3) max V_BATT = 4.8V -> 4.8/3 = 1.6V < 3.3V
- DWG. NO.
- REV.
- SHT.
- THIS DOCUMENT AND THE DATA DISCLOSED HEREIN OR HEREWITH IS THE PROPERTY OF ALTIUM LIMITED AND MAY BE FREELY DISTRIBUTED IN WHOLE. NO RIGHTS ARE RESERVED OR EXPRESS OR IMPLIED WARANTEE GIVEN.
- REVISION
- DESCRIPTION
- DATE
- APPROVED
- ENG:
- APPROVALS
- PROJECT
- DSN:
- CHK:
- REFERENCE DOCUMENTS
- PROJECT REVISION:
- TITLE
- DOCUMENT REVISION:
- DESIGN ITEM:
- BOM:
- FAB DWG:
- PCB DWG:
- ASSY DWG:
- SCALE:
- SIZE
- B
- CAGE CODE
- FILE NAME
- DWG NO.
- SHEET
- OF
- REV

### Library data of the parts
C23-C32 C34 = Ceramic Capacitor 0603: as C2 on sheet RFID Reader; Temperature: -55°C to +125°C; RoHS: TRUE; Material: Ceramic; Temperature Range High: +125°C; Lead Free: Yes; Octopart: https://octopart.com/c0603c104k5ractu-kemet-139244; Digikey Description: CAP CER 0.1UF 50V X7R 0603; Category: Cap; Package: C0603C-CF; ComponentLink2Description: Datasheet; Temperature Range Low: -55°C; Device Class L1: Passive Components; Voltage Rating: 50 V; Automotive: Yes; Device Class L3: Ceramic Capacitors; ComponentLink2URL: https://api.kemet.com/component-edge/download/datasheet/C0603C100J5GACAUTO.pdf; Device Class L2: Capacitors; Temperature Characteristic: X7R; Height: 0.87mm
  C23 C24: Supplier 1: Arrow Electronics; Supplier Part Number 1: CL10B104KB8NNNC
  C25-C32 C34: Supplier 1: Mouser; Supplier Part Number 1: 80-C0201C120K3G
C33 = Ceramic Capacitor 0805: as C1 on sheet RFID Reader; Temperature: -55°C to +125°C; RoHS: TRUE; Material: Ceramic; Temperature Range High: +125°C; Lead Free: Yes; Octopart: https://octopart.com/c0603c104k5ractu-kemet-139244; Digikey Description: CAP CER 0.1UF 50V X7R 0603; Category: Cap; ComponentLink2Description: Datasheet; Temperature Range Low: -55°C; Device Class L1: Passive Components; Voltage Rating: 50 V; Automotive: Yes; Device Class L3: Ceramic Capacitors; ComponentLink2URL: https://api.kemet.com/component-edge/download/datasheet/C0603C100J5GACAUTO.pdf; Device Class L2: Capacitors; Temperature Characteristic: X7R; Height: 0.87mm; Supplier 1: Arrow Electronics; Supplier Part Number 1: CL21B105KBFNNNG
D1 D2 = APG1005CGC-T: LED GREEN CLEAR CHIP SMD; Forward Voltage: 2V; Lens Color: Colorless; Test Current: 20mA; Dominant Wavelength: 571nm; Viewing Angle: 120°; Luminous Intensity: 35mcd; Width: 0.5mm; Case Code (Imperial): 0402; Package Quantity: 1; Case/Package: 0402; Packaging: Tape and Reel; Height: 0.25mm; Mount: Surface Mount; Case Code (Metric): 1005; Length: 1mm; Lead Free: Lead Free; Lens Transparency: Clear; Supplier 1: Digi-Key; Supplier Part Number 1: 754-1811-1-ND
J13 = 0901481104: 4 Position Receptacle Connector 0.100" (2.54mm) Through Hole, Right Angle Tin, connector for DSD TECH HM-10 Bluetooth 4.0 BLE iBeacon UART Module with 4PIN Base Board for Arduino UNO R3 Mega 2560 Nan; Supplier 1: Mouser; Supplier Part Number 1: 538-90148-1104
J14 = 5-146256-3: Header; Breakaway; 0.100 x 0.100 in.; PC Board; Dual; 6; 0.025 in.; 0.12 in.; Centerline_Pitch: 2.54 mm[.1 in]; Number_of_Positions: 6; MF: TE Connectivity; Product_Type: Connector; TE_purchase_URL: https://www.te.com/usa-en/product-5-146256-3.html?te_bu=Cor&te_type=disp&te_campaign=seda_glo_cor-seda-global-disp-prtnr-fy19-seda-model-bom-cta_sma-317_1&elqCampaignId=32493; SnapEDA_Link: https://www.snapeda.com/parts/5-146256-3/TE%20Connectivity/view-part/486039/?ref=snap; EU_RoHS_Compliance: Compliant; MP: 5-146256-3; Value: *; Package: None; Digi-Key_Part_Number: A121369-ND; Digi-Key_Purchase_URL: https://www.digikey.com/product-detail/en/te-connectivity-amp-connectors/5-146256-3/A121369-ND/1153559?utm_source=snapeda&utm_medium=aggregator&utm_campaign=symbol; Supplier 1: Arrow Electronics; Supplier Part Number 1: 5-146256-3
R20-R25 = Resistor 0603: as R1 on sheet RFID Reader; Tolerance: 1%; Datasheet Version: Rev. 7, 05/2017; Case Code - mm: 1608; Series: RC; Mounting Technology: SurfaceMount; Package Description: 2-Pin Surface Mount Device, Body 1.6 x 0.8 mm; Case Code - in: 0603; Package Reference: 0603; Product: ThickFilmResistorsGeneralPurpose; Manufacturer URL: http://www.yageo.com/; Termination Style: SMD/SMT; Operating Temperature Range: -55Cto+155C; Datasheet URL: http://www.yageo.com/documents/recent/PYu-RC_Group_51_RoHS_L_7.pdf; Packaging: Reel
SW1 = TS04-66-50-BK-260-SMT: Tactile Switch SPST-NO Top Actuated Surface Mount; Value: *; MP: TS04-66-50-BK-260-SMT; Package: None; Availability: Unavailable; Price: None; Supplier 1: Mouser; Supplier Part Number 1: 179-TS046650BK260SMT
TP1-TP11 = 5000: as TP16 on sheet Switch Network; Contact Finish - Termination: Silver (Ag); Reach SVHC Compliant: Yes; JESD-609 Code: e4; RoHS Compliant: Yes; Pins: 1; Mounting Technology: THT; Supplier 1: Future Electronics; Supplier Part Number 1: 8000564
U3 = STM32L452RET6P: IC MCU 32BIT 512KB FLASH 64LQFP; Manufacturer: STMicroelectronics; Frequency: 80MHz; Number Of Adc Channels: 16; Ram Size: 160KBytes; Max Junction Temp: +105°C; Number Of I2C Channels: 4; Number Of Cores: 1; Number Of I/Os: 52; Data Bus Width: 32bits; Max Supply Voltage: 3.6V; Standoff Height: 0.05mm; Min Supply Voltage: 1.05V; Core Architecture: ARM Cortex-M4; Memory Size: 512KBytes; Number Of Spi Channels: 3; Interface: I2C,SPI,UART,USART,CAN,USB,LIN,IrDA,Other; Number Of Pwm Channels: 20; Number Of Uart Channels: 5; Number Of Timers/Counters: 8; Ambient Temperature Range High: +85°C; Height: 1.6mm; Memory Type: FLASH; ComponentLink2Description: Datasheet; Number Of Usb Channels: 1; Number Of A/D Converters: 1; Automotive: No; RoHS: TRUE; ComponentLink2URL: https://www.st.com/resource/en/datasheet/stm32l452re.pdf; Digikey Description: IC MCU 32BIT 512KB FLASH 64LQFP; Temperature Range High: +105°C; Category: IC; Octopart: https://octopart.com/stm32l452ret6p-stmicroelectronics-82945027; Device Class L1: Integrated Circuits (ICs); Manufacturer Part Number: STM32L452RET6P; Temperature Range Low: -40°C; Device Class L3: Microcontrollers; Temperature: -40°C to +105°C; Device Class L2: Embedded Processors and Controllers; Ambient Temperature Range Low: -40°C; Lead Free: Yes; Package: LQFP64; Supplier 1: Mouser; Supplier Part Number 1: 511-STM32L452RET6P
Y2 = ABM3B-8.000MHZ-B2-T: Crystal 8MHz ±20ppm 18pF SMD-4 5mm x 3.2mm; ESR (Equivalent Series Resistance): 200R; Frequency Stability: 50ppm; Operating Frequency: 8 MHz; Mount: Surface Mount; Number of Pins: 4; Packaging: Tape and Reel; Width: 0.126inch; Case/Package: CSMD; Lead Free: Lead Free; Depth: 3.2mm; Load Capacitance: 18pF; Min Operating Temperature: -20°C; Series: ABM3B; Package Quantity: 1000; Resistor Type: Ceramic; Height: 0.043inch; Max Operating Temperature: 70°C; Frequency Tolerance: 20ppm; Series Resistance: 200R; Tolerance: 20ppm; Termination: SMD/SMT; Length: 5mm; Frequency: 8MHz; Supplier 1: Future Electronics; Supplier Part Number 1: 2481760

## Sheet Power Regulation.SchDoc
size B; Organization: MASA; SheetNumber: 7; SheetTotal: 7
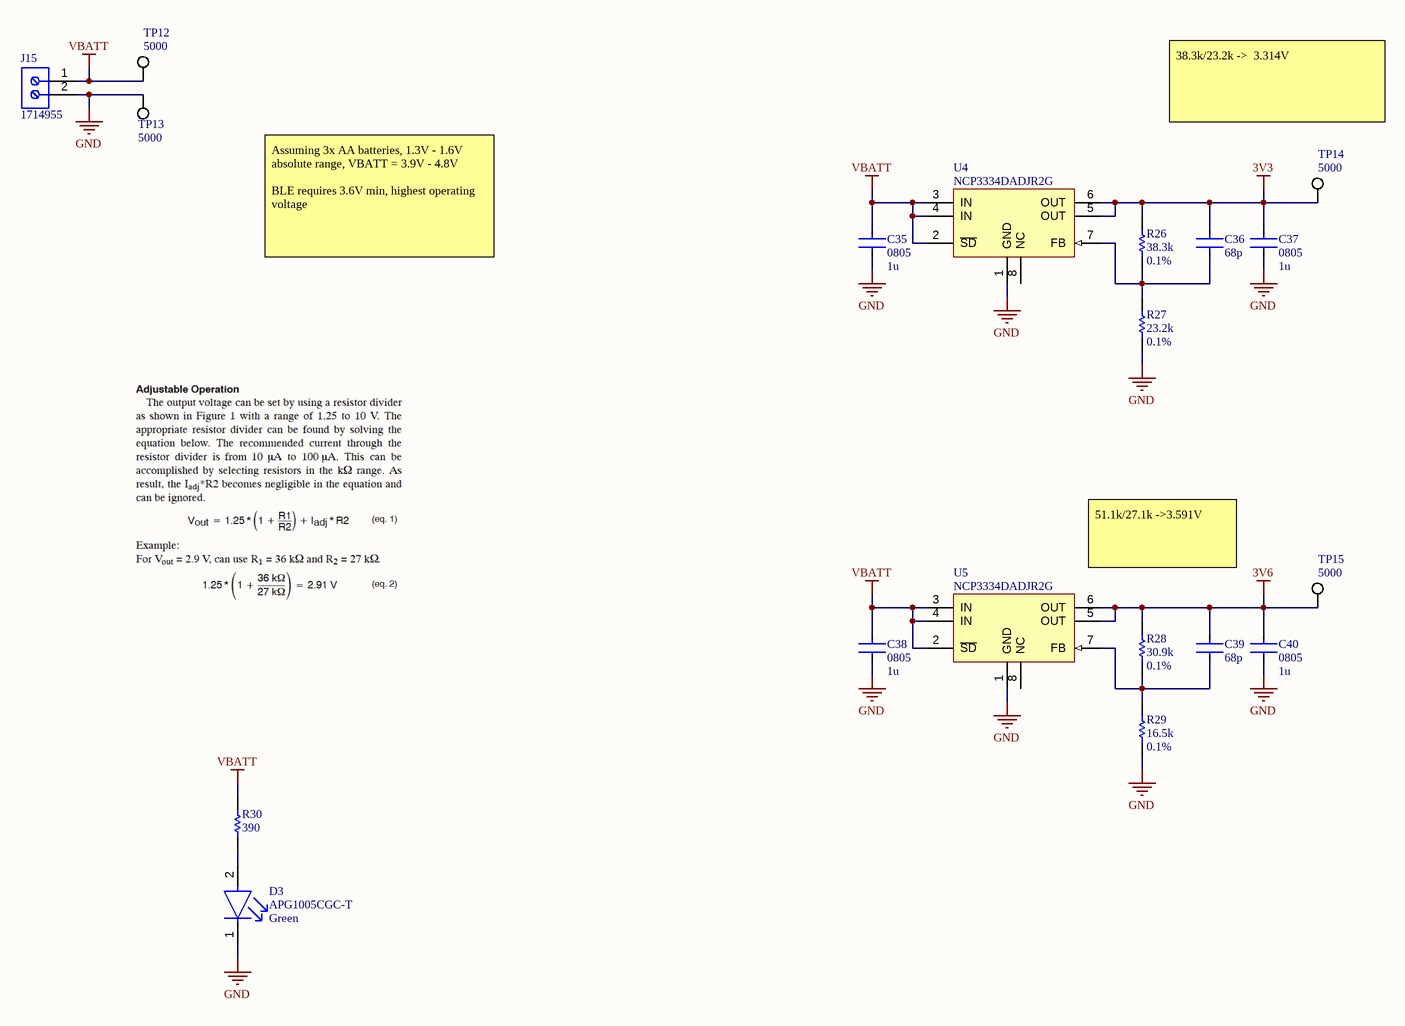
[diagram p6: Power Regulation.SchDoc]

### Parts
C35  value 1u  Package: 0805  [FP-0805-Capacitor-CL21-IPC_B]  (hidden comment: Ceramic Capacitor 0805)
C36  value 68p  [FP-0603-Capacitor-CL10-IPC_B]  (hidden comment: Ceramic Capacitor 0603)
C37  value 1u  Package: 0805  [FP-0805-Capacitor-CL21-IPC_B]  (hidden comment: Ceramic Capacitor 0805)
C38  value 1u  Package: 0805  [FP-0805-Capacitor-CL21-IPC_B]  (hidden comment: Ceramic Capacitor 0805)
C39  value 68p  [FP-0603-Capacitor-CL10-IPC_B]  (hidden comment: Ceramic Capacitor 0603)
C40  value 1u  Package: 0805  [FP-0805-Capacitor-CL21-IPC_B]  (hidden comment: Ceramic Capacitor 0805)
D3  APG1005CGC-T  Color: Green  [FP-APG1005CGC-T-MFG]
J15  1714955  [1714955]
R26  value 38.3k  Tolerance: 0.1%  [RESC1608X55X25NL10T15]  (hidden comment: RC0603FR-072K2L)
R27  value 23.2k  Tolerance: 0.1%  [RESC1608X55X25NL10T15]  (hidden comment: RC0603FR-072K2L)
R28  value 30.9k  Tolerance: 0.1%  [RESC1608X55X25NL10T15]  (hidden comment: RC0603FR-072K2L)
R29  value 16.5k  Tolerance: 0.1%  [RESC1608X55X25NL10T15]  (hidden comment: RC0603FR-072K2L)
R30  value 390  [RESC1608X55X25NL10T15]  (hidden comment: RC0603FR-072K2L)
TP12  5000  [FP-5000-MFG]
TP13  5000  [FP-5000-MFG]
TP14  5000  [FP-5000-MFG]
TP15  5000  [FP-5000-MFG]
U4  NCP3334DADJR2G  [NCP3334DADJR2G]
U5  NCP3334DADJR2G  [NCP3334DADJR2G]

### Nets
3V3: C36.1 C37.1 R26.2 TP14.1 U4.5(OUT) U4.6(OUT)
3V6: C39.1 C40.1 R28.2 TP15.1 U5.5(OUT) U5.6(OUT)
GND: C35.2 C37.2 C38.2 C40.2 D3.1(C) J15.2 R27.1 R29.1 TP13.1 U4.1(GND) U5.1(GND)
VBATT: C35.1 C38.1 J15.1 R30.2 TP12.1 U4.2(~{SD}) U4.3(IN) U4.4(IN) U5.2(~{SD}) U5.3(IN) U5.4(IN)
NetC36_2: C36.2 R26.1 R27.2 U4.7(FB)
NetC39_2: C39.2 R28.1 R29.2 U5.7(FB)
NetD3_2: D3.2(A) R30.1

Not connected (* = marked no-connect by the designer): U4 8(NC); U5 8(NC)

### Notes on the sheet
- 38.3k/23.2k ->  3.314V
- Assuming 3x AA batteries, 1.3V - 1.6V absolute range, VBATT = 3.9V - 4.8V
  BLE requires 3.6V min, highest operating voltage
- 51.1k/27.1k ->3.591V
- DWG. NO.
- REV.
- SHT.
- THIS DOCUMENT AND THE DATA DISCLOSED HEREIN OR HEREWITH IS THE PROPERTY OF ALTIUM LIMITED AND MAY BE FREELY DISTRIBUTED IN WHOLE. NO RIGHTS ARE RESERVED OR EXPRESS OR IMPLIED WARANTEE GIVEN.
- REVISION
- DESCRIPTION
- DATE
- APPROVED
- ENG:
- APPROVALS
- PROJECT
- DSN:
- CHK:
- REFERENCE DOCUMENTS
- PROJECT REVISION:
- TITLE
- DOCUMENT REVISION:
- DESIGN ITEM:
- BOM:
- FAB DWG:
- PCB DWG:
- ASSY DWG:
- SCALE:
- SIZE
- B
- CAGE CODE
- FILE NAME
- DWG NO.
- SHEET
- OF
- REV

### Library data of the parts
C35 C37 C38 C40 = Ceramic Capacitor 0805: as C1 on sheet RFID Reader; Temperature: -55°C to +125°C; RoHS: TRUE; Material: Ceramic; Temperature Range High: +125°C; Lead Free: Yes; Octopart: https://octopart.com/c0603c104k5ractu-kemet-139244; Digikey Description: CAP CER 0.1UF 50V X7R 0603; Category: Cap; ComponentLink2Description: Datasheet; Temperature Range Low: -55°C; Device Class L1: Passive Components; Voltage Rating: 50 V; Automotive: Yes; Device Class L3: Ceramic Capacitors; ComponentLink2URL: https://api.kemet.com/component-edge/download/datasheet/C0603C100J5GACAUTO.pdf; Device Class L2: Capacitors; Temperature Characteristic: X7R; Height: 0.87mm; Supplier 1: Arrow Electronics; Supplier Part Number 1: CL21B105KBFNNNG
C36 C39 = Ceramic Capacitor 0603: as C2 on sheet RFID Reader; Temperature: -55°C to +125°C; RoHS: TRUE; Material: Ceramic; Temperature Range High: +125°C; Lead Free: Yes; Octopart: https://octopart.com/c0603c104k5ractu-kemet-139244; Digikey Description: CAP CER 0.1UF 50V X7R 0603; Category: Cap; Package: C0603C-CF; ComponentLink2Description: Datasheet; Temperature Range Low: -55°C; Device Class L1: Passive Components; Voltage Rating: 50 V; Automotive: Yes; Device Class L3: Ceramic Capacitors; ComponentLink2URL: https://api.kemet.com/component-edge/download/datasheet/C0603C100J5GACAUTO.pdf; Device Class L2: Capacitors; Temperature Characteristic: X7R; Height: 0.87mm; Supplier 1: Mouser; Supplier Part Number 1: 80-C0201C120K3G
D3 = APG1005CGC-T: as D1 on sheet Microcontroller; Width: 0.5mm; Case Code (Imperial): 0402; Package Quantity: 1; Case/Package: 0402; Packaging: Tape and Reel; Height: 0.25mm; Mount: Surface Mount; Case Code (Metric): 1005; Length: 1mm; Lead Free: Lead Free; Lens Transparency: Clear; Supplier 1: Digi-Key; Supplier Part Number 1: 754-1811-1-ND
J15 = 1714955: PC Terminal Block, Pitch 6.35 mm, 1 x 2 Position, Height 21.5 mm, Tail Lenght 5.1 mm, RoHS, Bulk; Manufacturer: Phoenix Contact; Package Description: PC Terminal Block, Pitch 6.35 mm, 1 x 2 Position, Height 21.5 mm, Tail Lenght 5.1 mm; Datasheet URL: http://media.digikey.com/pdf/Data%20Sheets/Phoenix%20Contact%20PDFs/1714955.pdf; Package Reference: 1714955; Manufacturer URL: http://www.phoenixcontact.com/; Datasheet Version: 02/2010; Mounting Technology: ThroughHole; Supplier 1: Arrow Electronics; Supplier Part Number 1: 1714955
R26-R30 = Resistor 0603: as R1 on sheet RFID Reader; Datasheet Version: Rev. 7, 05/2017; Case Code - mm: 1608; Series: RC; Mounting Technology: SurfaceMount; Package Description: 2-Pin Surface Mount Device, Body 1.6 x 0.8 mm; Case Code - in: 0603; Package Reference: 0603; Product: ThickFilmResistorsGeneralPurpose; Manufacturer URL: http://www.yageo.com/; Termination Style: SMD/SMT; Operating Temperature Range: -55Cto+155C; Datasheet URL: http://www.yageo.com/documents/recent/PYu-RC_Group_51_RoHS_L_7.pdf; Packaging: Reel
  R30: Tolerance: 1%
TP12-TP15 = 5000: as TP16 on sheet Switch Network; Contact Finish - Termination: Silver (Ag); Reach SVHC Compliant: Yes; JESD-609 Code: e4; RoHS Compliant: Yes; Pins: 1; Mounting Technology: THT; Supplier 1: Future Electronics; Supplier Part Number 1: 8000564
U4 U5 = NCP3334DADJR2G: Linear Voltage Regulator IC Positive Adjustable 1 Output 500mA 8-SOIC; Supplier 1: Arrow Electronics; Supplier Part Number 1: NCP3334DADJR2G

## Nets that join several sheets
3V3: RFID Reader (7 pins), Switch Network/Switch1 (C22.1.1 R18.1.2 R19.1.2 U2.1.2), Switch Network/Switch2 (C22.2.1 R18.2.2 R19.2.2 U2.2.2), Switch Network/Switch3 (C22.3.1 R18.3.2 R19.3.2 U2.3.2), Switch Network/Switch4 (C22.4.1 R18.4.2 R19.4.2 U2.4.2), Microcontroller (17 pins), Power Regulation (6 pins)
3V6: Microcontroller (J13.4), Power Regulation (6 pins)
GND: RFID Reader (36 pins), Switch Network (T1.3 T1.5 TP19.1), Switch Network/Switch1 (9 pins), Switch Network/Switch2 (9 pins), Switch Network/Switch3 (9 pins), Switch Network/Switch4 (9 pins), Antenna Connectors (48 pins), Microcontroller (29 pins), Power Regulation (11 pins)
VBATT: Microcontroller (U3.1), Power Regulation (11 pins)
ANTENNA_N: RFID Reader (8 pins), Switch Network (T1.4 TP18.1)
ANTENNA_P: RFID Reader (8 pins), Switch Network (T1.6 TP16.1)
NetT1_1: Switch Network (T1.1 TP17.1), Switch Network/Switch4 (U2.4.11)
NetU2.1_11: Switch Network/Switch1 (U2.1.11), Switch Network/Switch4 (U2.4.13)
NetU2.2_11: Switch Network/Switch2 (U2.2.11), Switch Network/Switch4 (U2.4.6)
NetU2.3_11: Switch Network/Switch3 (U2.3.11), Switch Network/Switch4 (U2.4.8)
RF0: Switch Network/Switch1 (U2.1.13), Antenna Connectors (J1.1)
RF1: Switch Network/Switch1 (U2.1.15), Antenna Connectors (J2.1)
RF2: Switch Network/Switch1 (U2.1.6), Antenna Connectors (J3.1)
RF3: Switch Network/Switch1 (U2.1.8), Antenna Connectors (J4.1)
RF4: Switch Network/Switch2 (U2.2.13), Antenna Connectors (J5.1)
RF5: Switch Network/Switch2 (U2.2.15), Antenna Connectors (J6.1)
RF6: Switch Network/Switch2 (U2.2.6), Antenna Connectors (J7.1)
RF7: Switch Network/Switch2 (U2.2.8), Antenna Connectors (J8.1)
RF8: Switch Network/Switch3 (U2.3.13), Antenna Connectors (J9.1)
RF9: Switch Network/Switch3 (U2.3.15), Antenna Connectors (J10.1)
RF10: Switch Network/Switch3 (U2.3.6), Antenna Connectors (J11.1)
RF11: Switch Network/Switch3 (U2.3.8), Antenna Connectors (J12.1)
~{SPI_RFID_CS}: RFID Reader (U1.15), Microcontroller (TP4.1 U3.20)
SEL0: Switch Network/Switch1 (R18.1.1 U2.1.4), Microcontroller (U3.10)
SEL1: Switch Network/Switch1 (R19.1.1 U2.1.3), Microcontroller (U3.9)
SEL2: Switch Network/Switch2 (R18.2.1 U2.2.4), Microcontroller (U3.36)
SEL3: Switch Network/Switch2 (R19.2.1 U2.2.3), Microcontroller (U3.35)
SEL4: Switch Network/Switch3 (R18.3.1 U2.3.4), Microcontroller (U3.38)
SEL5: Switch Network/Switch3 (R19.3.1 U2.3.3), Microcontroller (U3.37)
SEL6: Switch Network/Switch4 (R18.4.1 U2.4.4), Microcontroller (U3.34)
SEL7: Switch Network/Switch4 (R19.4.1 U2.4.3), Microcontroller (U3.33)
SPI_RFID_MISO: RFID Reader (U1.16), Microcontroller (TP2.1 U3.22)
SPI_RFID_MOSI: RFID Reader (U1.17), Microcontroller (TP3.1 U3.23)
SPI_RFID_SCK: RFID Reader (U1.18), Microcontroller (TP1.1 U3.15)
UART_RFID_RX/~{IRQ_OUT}: RFID Reader (R12.1 U1.14), Microcontroller (U3.29)
UART_RFID_TX/~{IRQ_IN}: RFID Reader (R13.1 U1.12), Microcontroller (U3.24)